# Altium project PiMX8MIO_release.PrjPcb
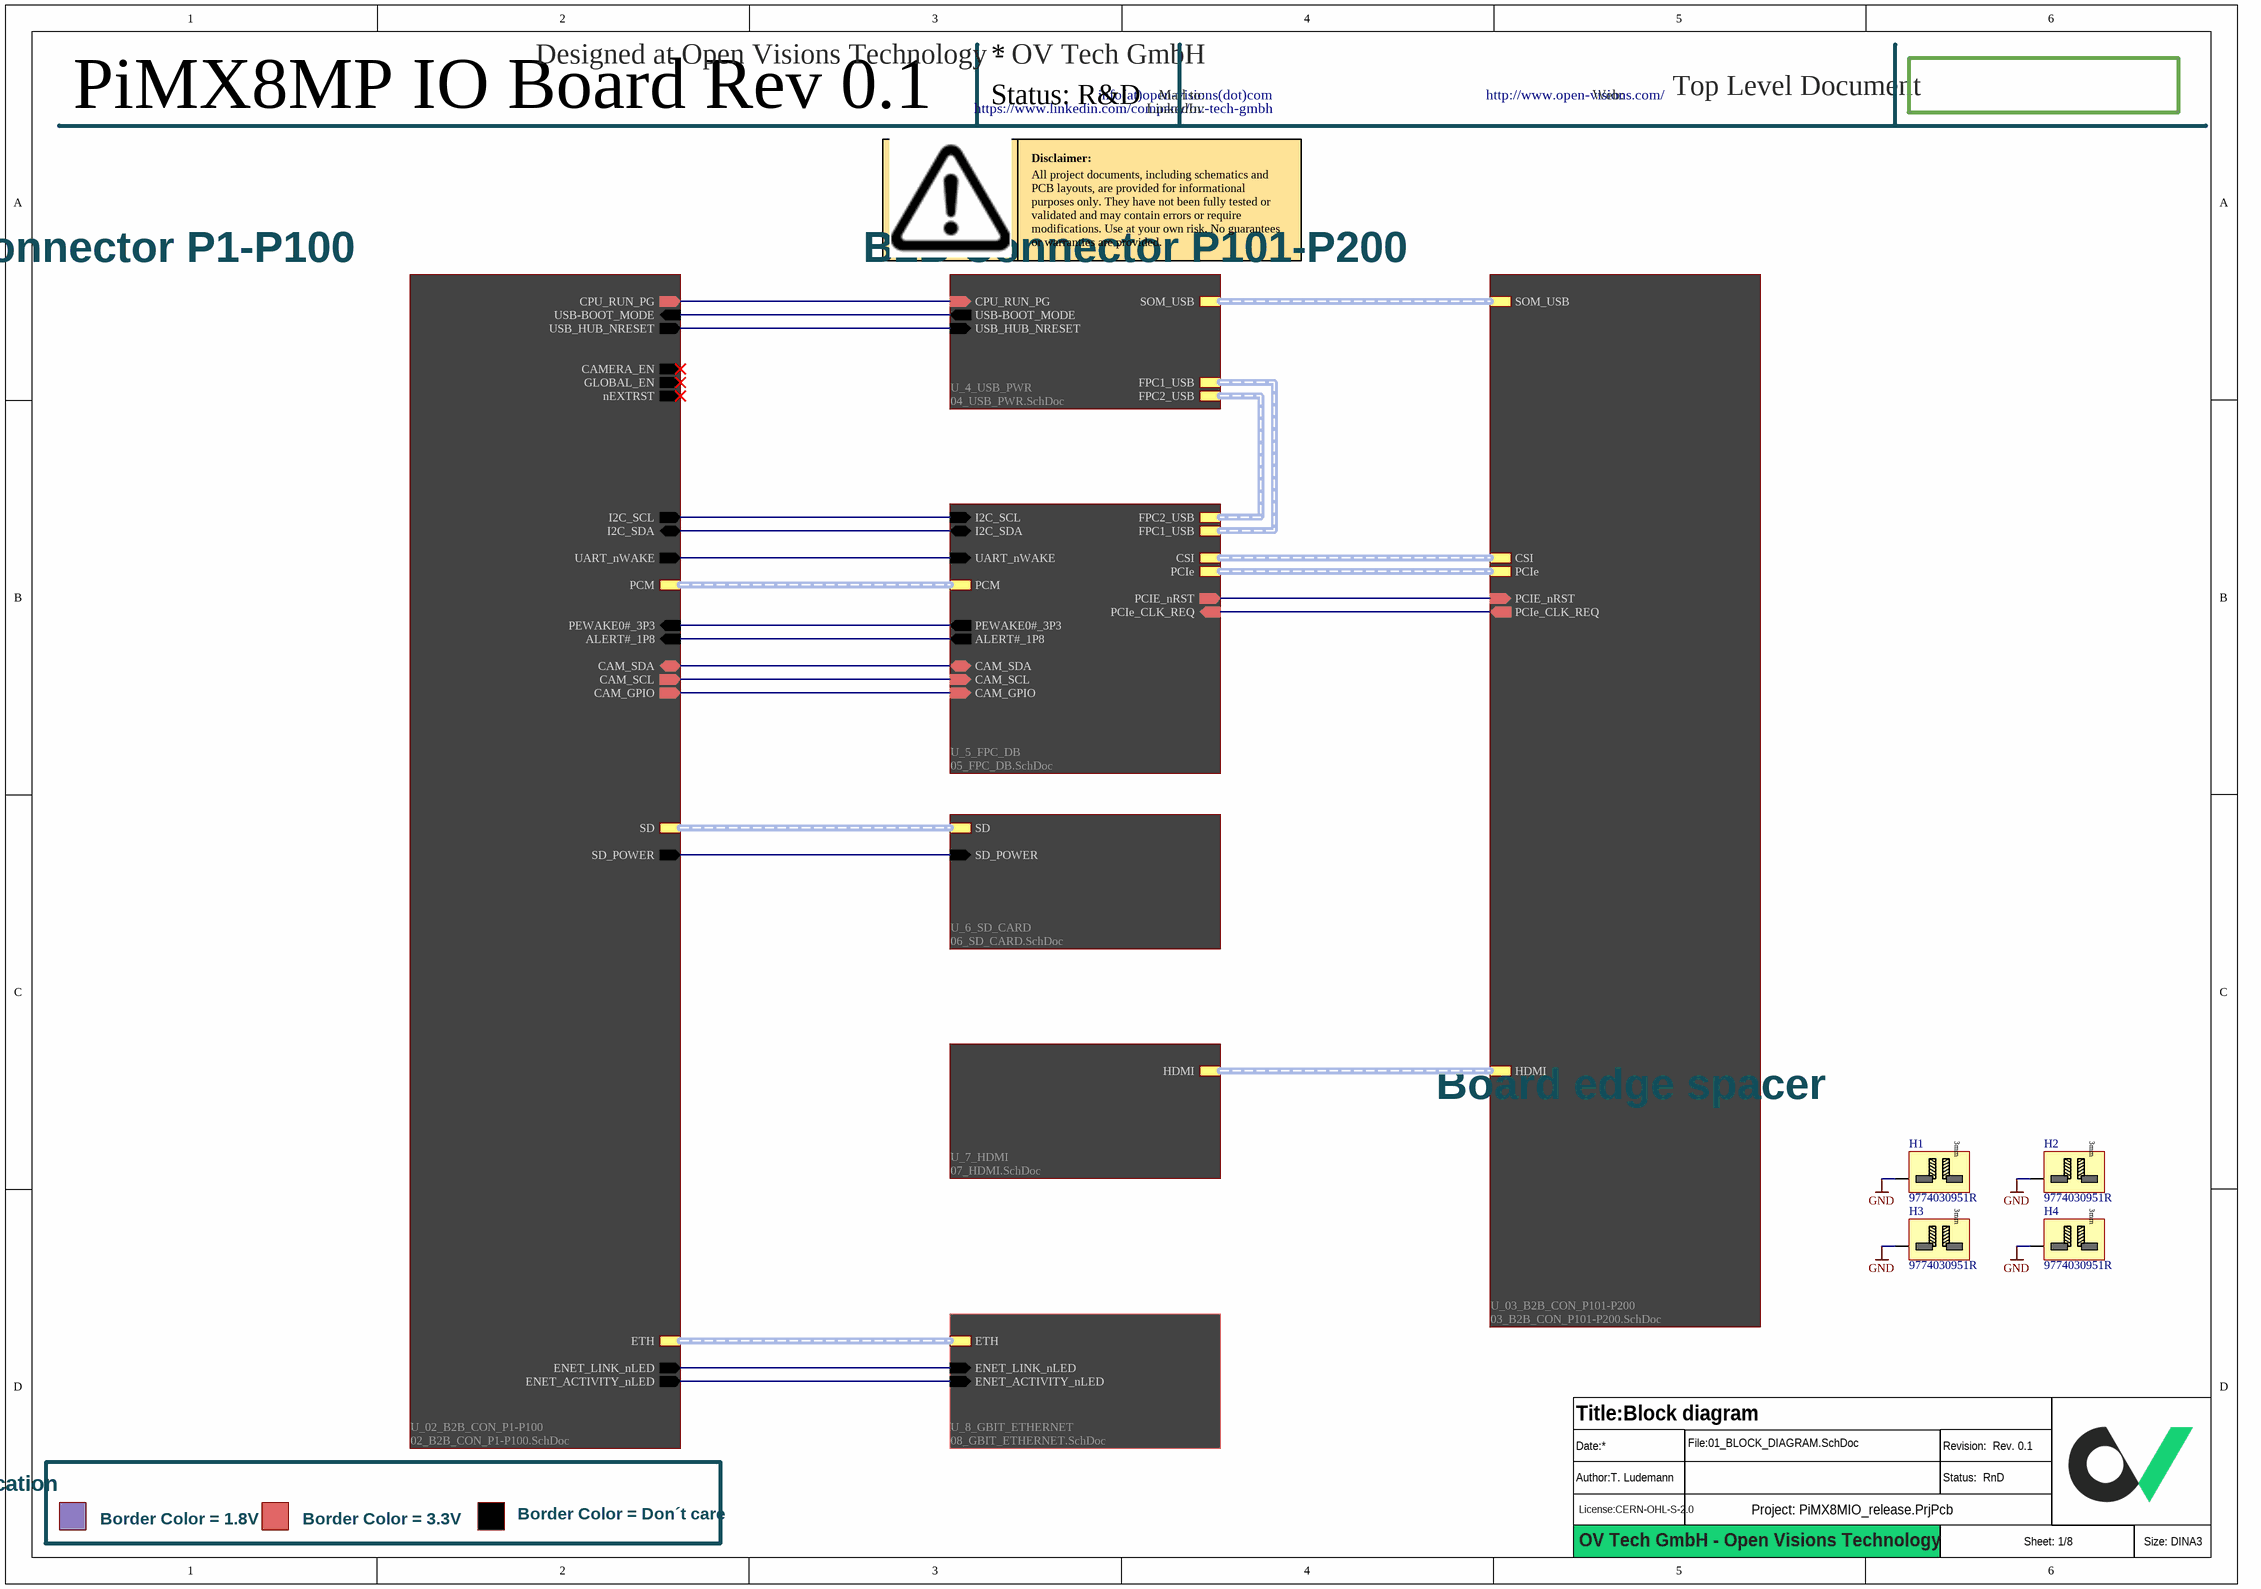
[diagram p0: 01_BLOCK_DIAGRAM.SchDoc]
ConfidialityLevel: Open-Source; Customer: OV Tech GmbH; DevStatus: RnD; License: CERN-OHL-S-2.0; PCBTitle: PiMX8MP IO Board; Project: PiMX8MP; Revision: Rev. 0.1
8 sheets, 139 parts. Net scope: hierarchical (ports join the sheet entries above them; power ports are global).
Board file: PiMX8MPIO_r0.1.PcbDoc
Sheets:
  01_BLOCK_DIAGRAM.SchDoc
    U_02_B2B_CON_P1-P100 = 02_B2B_CON_P1-P100.SchDoc
    U_4_USB_PWR = 04_USB_PWR.SchDoc
    U_5_FPC_DB = 05_FPC_DB.SchDoc
    U_6_SD_CARD = 06_SD_CARD.SchDoc
    U_7_HDMI = 07_HDMI.SchDoc
    U_8_GBIT_ETHERNET = 08_GBIT_ETHERNET.SchDoc
    U_03_B2B_CON_P101-P200 = 03_B2B_CON_P101-P200.SchDoc

## Sheet 01_BLOCK_DIAGRAM.SchDoc: Block diagram
size 420 x 297 mm; Author: T. Ludemann; SheetNumber: 1; SheetTotal: 8; DocSize: DINA3

### Parts
(Parts that share a designator on the sheet are numbered #1, #2 ... from top to bottom, then left to right.)
?#1  (no value)  (graphical)
H1  9774030951R  [Spacer_SMD_Ø2.7mmx3mm_9774030951]
H2  9774030951R  [Spacer_SMD_Ø2.7mmx3mm_9774030951]
H3  9774030951R  [Spacer_SMD_Ø2.7mmx3mm_9774030951]
H4  9774030951R  [Spacer_SMD_Ø2.7mmx3mm_9774030951]

### Sub-sheets
U_02_B2B_CON_P1-P100 = 02_B2B_CON_P1-P100.SchDoc: CPU_RUN_PG (out), USB-BOOT_MODE (in), USB_HUB_NRESET (out), SD (harness SD), SD_POWER (out), ETH (harness ETH), ENET_LINK_nLED (out), ENET_ACTIVITY_nLED (out), CAMERA_EN (out), GLOBAL_EN (out), nEXTRST (out), I2C_SCL (out), I2C_SDA (bidir), PEWAKE0#_3P3 (in), ALERT#_1P8 (in), UART_nWAKE (out), PCM (harness PCM), CAM_SDA (bidir), CAM_SCL (out), CAM_GPIO (out)
U_03_B2B_CON_P101-P200 = 03_B2B_CON_P101-P200.SchDoc: SOM_USB (harness SOM_USB), HDMI (harness HDMI), CSI (harness CSI), PCIe (harness PCIe), PCIE_nRST (in), PCIe_CLK_REQ (out)
U_4_USB_PWR = 04_USB_PWR.SchDoc: SOM_USB (harness SOM_USB), CPU_RUN_PG (in), USB-BOOT_MODE (out), USB_HUB_NRESET (in), FPC1_USB (harness FPC1_USB), FPC2_USB (harness FPC2_USB)
U_5_FPC_DB = 05_FPC_DB.SchDoc: CSI (harness CSI), PCIe (harness PCIe), FPC2_USB (harness FPC2_USB), FPC1_USB (harness FPC1_USB), PCIE_nRST (out), PCIe_CLK_REQ (in), I2C_SCL (in), I2C_SDA (bidir), PEWAKE0#_3P3 (out), ALERT#_1P8 (out), UART_nWAKE (in), PCM (harness PCM), CAM_SDA (bidir), CAM_SCL (in), CAM_GPIO (in)
U_6_SD_CARD = 06_SD_CARD.SchDoc: SD (harness SD), SD_POWER (in)
U_7_HDMI = 07_HDMI.SchDoc: HDMI (harness HDMI)
U_8_GBIT_ETHERNET = 08_GBIT_ETHERNET.SchDoc: ETH (harness ETH), ENET_LINK_nLED (in), ENET_ACTIVITY_nLED (in)

### Nets
GND: H1.MT H2.MT H3.MT H4.MT
ALERT#_1P8: sheet U_02_B2B_CON_P1-P100/ALERT#_1P8, sheet U_5_FPC_DB/ALERT#_1P8
CAM_GPIO: sheet U_02_B2B_CON_P1-P100/CAM_GPIO, sheet U_5_FPC_DB/CAM_GPIO
CAM_I2C_SCL: sheet U_02_B2B_CON_P1-P100/CAM_SCL, sheet U_5_FPC_DB/CAM_SCL
CAM_I2C_SDA: sheet U_02_B2B_CON_P1-P100/CAM_SDA, sheet U_5_FPC_DB/CAM_SDA
CPU_RUN_PG: sheet U_02_B2B_CON_P1-P100/CPU_RUN_PG, sheet U_4_USB_PWR/CPU_RUN_PG
ENET_ACTIVITY_nLED: sheet U_02_B2B_CON_P1-P100/ENET_ACTIVITY_nLED, sheet U_8_GBIT_ETHERNET/ENET_ACTIVITY_nLED
ENET_LINK_nLED: sheet U_02_B2B_CON_P1-P100/ENET_LINK_nLED, sheet U_8_GBIT_ETHERNET/ENET_LINK_nLED
FPC_PEWAKE0#_3P3: sheet U_02_B2B_CON_P1-P100/PEWAKE0#_3P3, sheet U_5_FPC_DB/PEWAKE0#_3P3
I2C_SCL: sheet U_02_B2B_CON_P1-P100/I2C_SCL, sheet U_5_FPC_DB/I2C_SCL
I2C_SDA: sheet U_02_B2B_CON_P1-P100/I2C_SDA, sheet U_5_FPC_DB/I2C_SDA
PCIe_CLK_REQ: sheet U_5_FPC_DB/PCIe_CLK_REQ, sheet U_03_B2B_CON_P101-P200/PCIe_CLK_REQ
PCIE_nRST: sheet U_5_FPC_DB/PCIE_nRST, sheet U_03_B2B_CON_P101-P200/PCIE_nRST
SD_POWER: sheet U_02_B2B_CON_P1-P100/SD_POWER, sheet U_6_SD_CARD/SD_POWER
UART_nWAKE: sheet U_02_B2B_CON_P1-P100/UART_nWAKE, sheet U_5_FPC_DB/UART_nWAKE
USB-BOOT_MODE: sheet U_02_B2B_CON_P1-P100/USB-BOOT_MODE, sheet U_4_USB_PWR/USB-BOOT_MODE
USB_HUB_NRESET: sheet U_02_B2B_CON_P1-P100/USB_HUB_NRESET, sheet U_4_USB_PWR/USB_HUB_NRESET

### Buses and harness runs
harness sheet U_02_B2B_CON_P1-P100/ETH = sheet U_8_GBIT_ETHERNET/ETH
harness sheet U_02_B2B_CON_P1-P100/PCM = sheet U_5_FPC_DB/PCM
harness sheet U_02_B2B_CON_P1-P100/SD = sheet U_6_SD_CARD/SD
harness sheet U_03_B2B_CON_P101-P200/CSI = sheet U_5_FPC_DB/CSI
harness sheet U_03_B2B_CON_P101-P200/HDMI = sheet U_7_HDMI/HDMI
harness sheet U_03_B2B_CON_P101-P200/PCIe = sheet U_5_FPC_DB/PCIe
harness sheet U_03_B2B_CON_P101-P200/SOM_USB = sheet U_4_USB_PWR/SOM_USB
harness sheet U_4_USB_PWR/FPC1_USB = sheet U_5_FPC_DB/FPC1_USB
harness sheet U_4_USB_PWR/FPC2_USB = sheet U_5_FPC_DB/FPC2_USB

### Notes on the sheet
- PiMX8MP IO Board Rev 0.1
- Status: R&D
- Designed at Open Visions Technology - OV Tech GmbH
- Mail to:
- LinkedIn:
- info(at)open-visions(dot)com
- https://www.linkedin.com/company/ov-tech-gmbh
- Web:
- http://www.open-visions.com/
- Top Level Document
- Disclaimer:
- B2B Connector P1-P100
- All project documents, including schematics and PCB layouts, are provided for informational purposes only. They have not been fully tested or validated and may contain errors or require modifications. Use at your own risk. No guarantees or warranties are provided.
- B2B Connector P101-P200
- USB + Power
- FPC DB Connector
- SD Card
- HDMI
- Board edge spacer
- Gbit Ethernet
- Signal Level Indication
- Border Color = 1.8V
- Border Color = 3.3V
- Border Color = Don´t care
- OV Tech GmbH - Open Visions Technology
- (in symbol Spacer_SMD_Ø2.7mm_internal_3mm) 3mm

### Library data of the parts
?#1 = Titleblock_01_OpenSource
H1-H4 = Spacer_SMD_Ø2.7mm_internal_3mm: Würth Elektronik SMD Spacer Ø2.7mm 3mm length; Manufacturer 1: Würth Elektronik; Manufacturer 1 Prt. Nr.: 9774030951R

## Sheet 02_B2B_CON_P1-P100.SchDoc: PiMX8MP Board to board connector P1 - P100
size 420 x 297 mm; Author: T. Ludemann; SheetNumber: 2; SheetTotal: 8; DocSize: DINA3
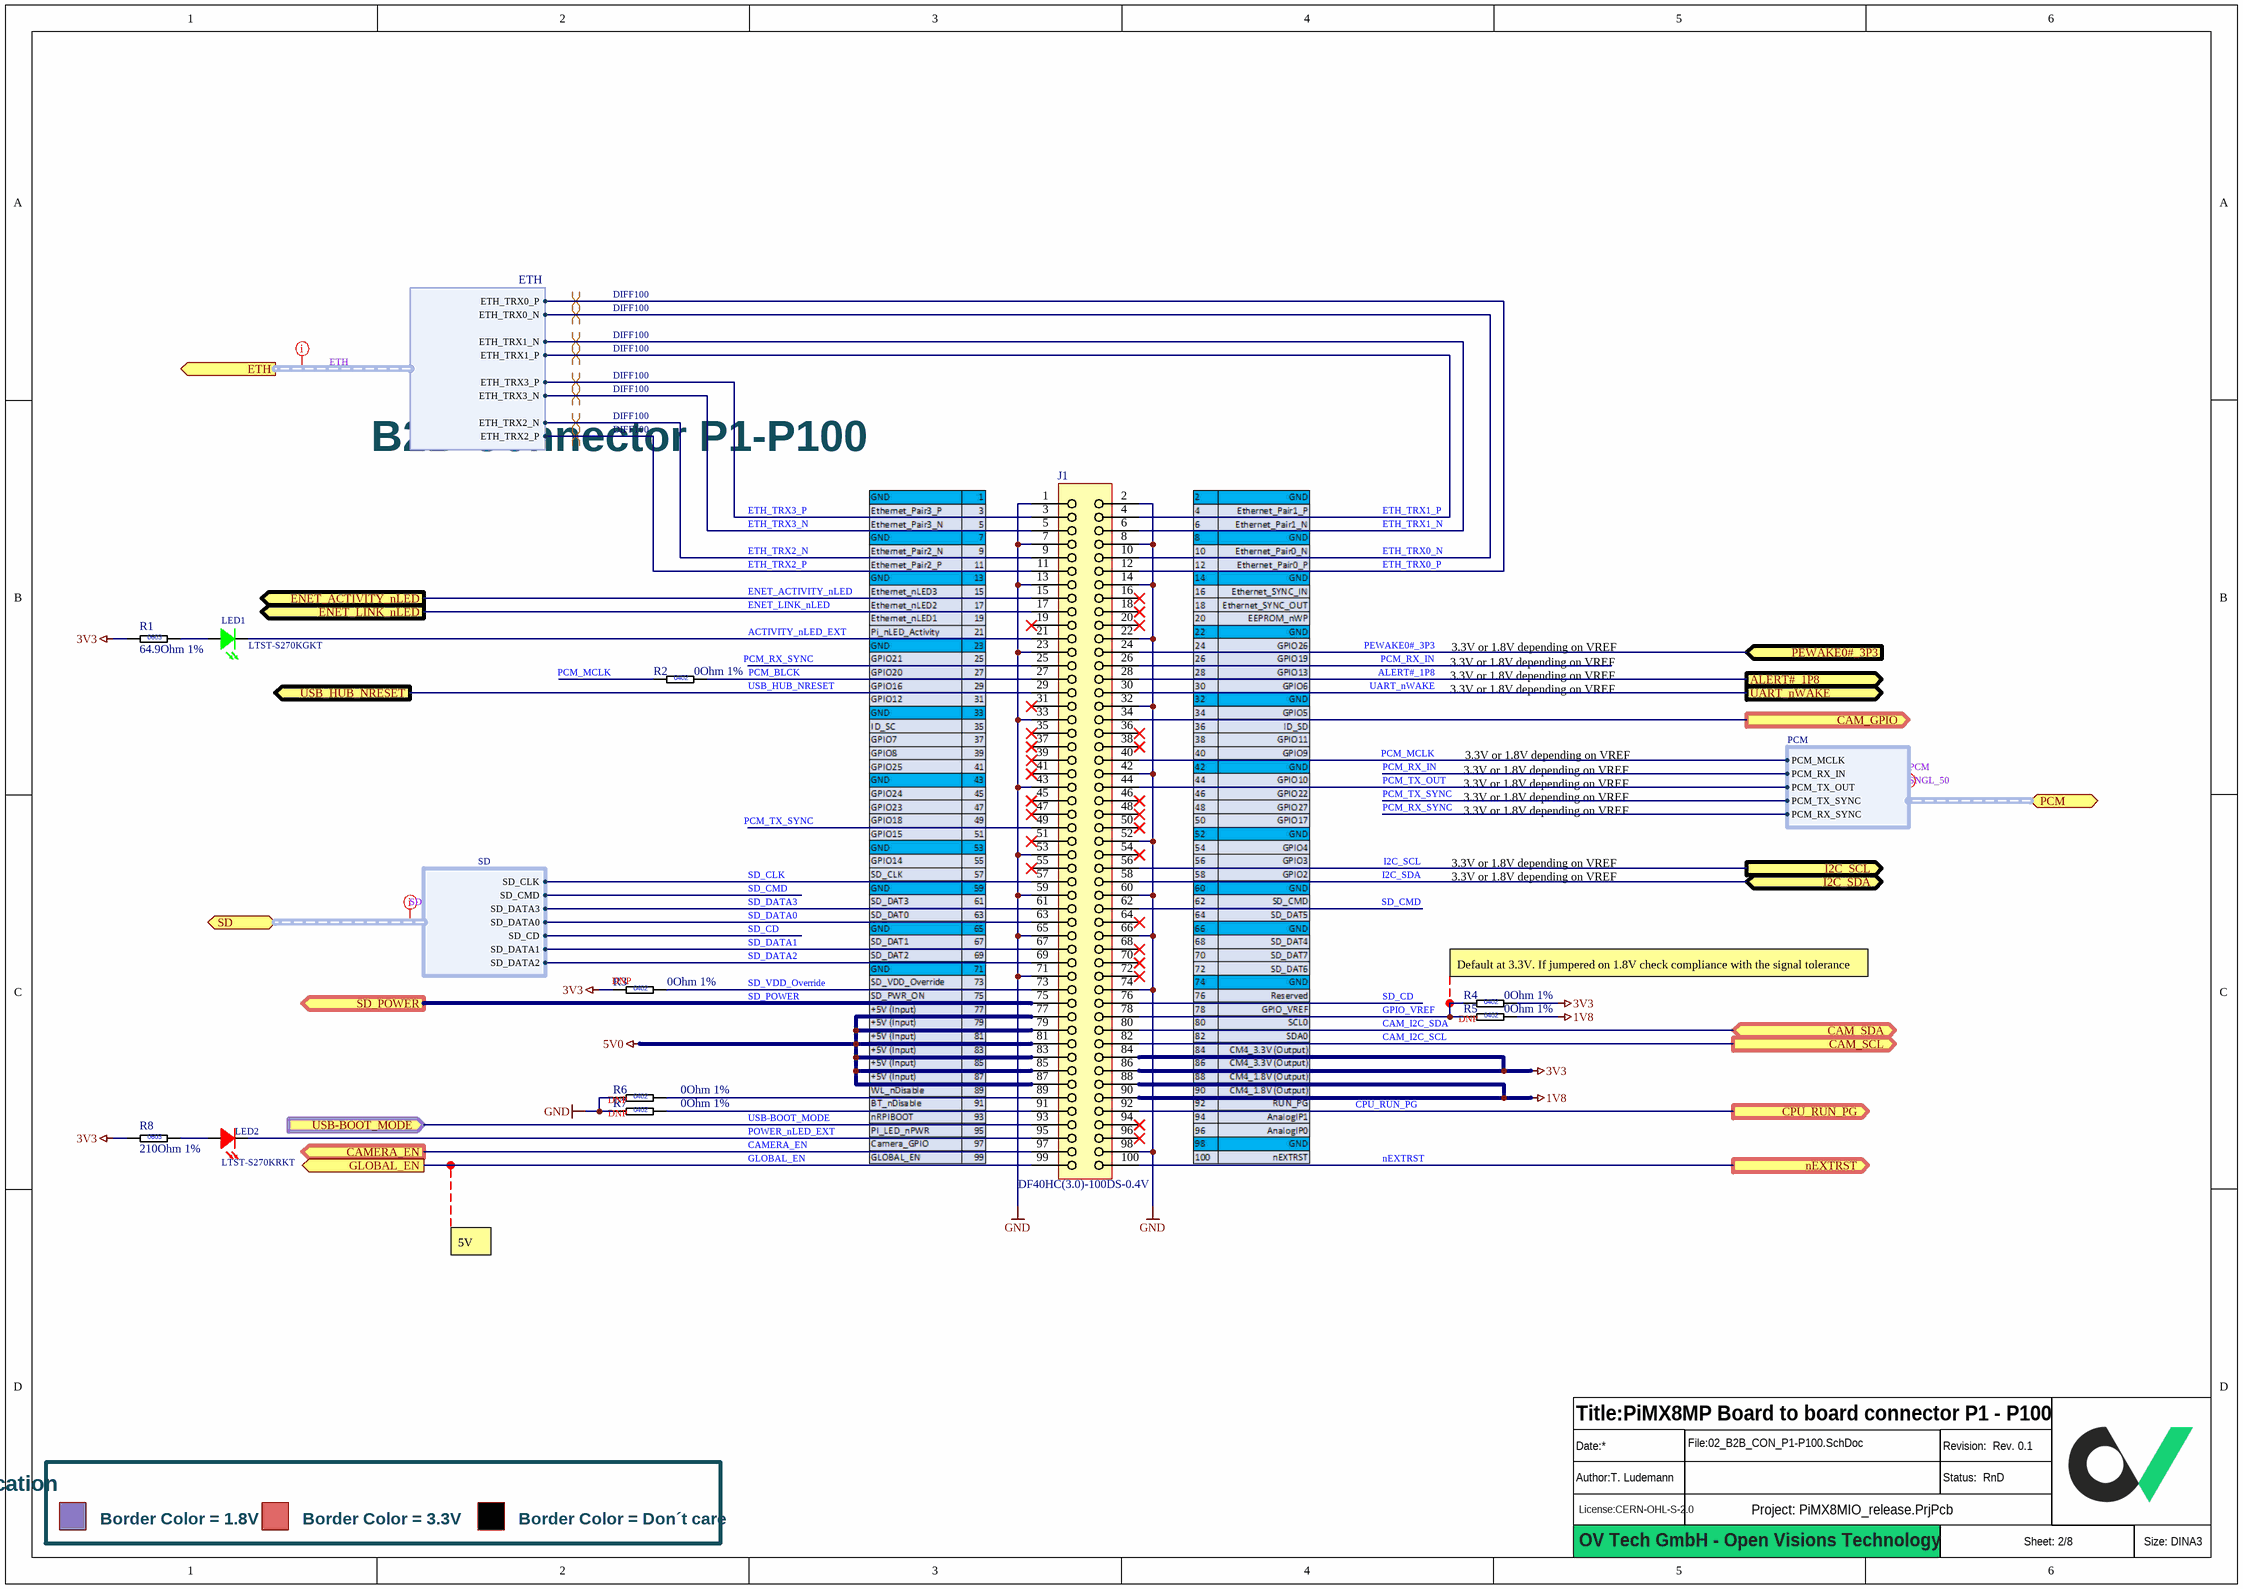
[diagram p1: 02_B2B_CON_P1-P100.SchDoc]

### Parts
(Parts that share a designator on the sheet are numbered #1, #2 ... from top to bottom, then left to right.)
?#2  (no value)  (graphical)
J1  DF40HC(3.0)-100DS-0.4V  [BOARD-TO-BOARD DF40HC(3.0)-100DS-0.4V]
LED1  LTST-S270KGKT  [LED 0605_LTST-S270KRKT]
LED2  LTST-S270KRKT  [LED 0605_LTST-S270KRKT]
R1  64.9Ohm 1%  [RESC1608X04L]
R2  0Ohm 1%  [RESC1005X04L]
R3  0Ohm 1%  [RESC1005X04L]
R4  0Ohm 1%  [RESC1005X04L]
R5  0Ohm 1%  [RESC1005X04L]
R6  0Ohm 1%  [RESC1005X04L]
R7  0Ohm 1%  [RESC1005X04L]
R8  210Ohm 1%  [RESC1608X04L]

### Ports
ALERT#_1P8 (out), CAM_GPIO (out), CAM_SCL (out), CAM_SDA (bidir), CAMERA_EN (out), CPU_RUN_PG (out), ENET_ACTIVITY_nLED (out), ENET_LINK_nLED (out), ETH (out, harness ETH), GLOBAL_EN (out), I2C_SCL (out), I2C_SDA (bidir), nEXTRST (out), PCM (bidir, harness PCM), PEWAKE0#_3P3 (in), SD (bidir, harness SD), SD_POWER (out), UART_nWAKE (out), USB-BOOT_MODE (in), USB_HUB_NRESET (out)

### Harnesses
ETH: ETH_TRX0_P, ETH_TRX0_N, ETH_TRX1_N, ETH_TRX1_P, ETH_TRX2_P, ETH_TRX2_N, ETH_TRX3_P, ETH_TRX3_N
SD: SD_CLK, SD_CMD, SD_CD, SD_DATA0, SD_DATA1, SD_DATA2, SD_DATA3
PCM: PCM_MCLK, PCM_TX_OUT, PCM_RX_IN, PCM_TX_SYNC, PCM_RX_SYNC

### Nets
1V8: J1.88 J1.90 R5.2
3V3: J1.84 J1.86 R1.1 R3.1 R4.2 R8.1
5V0: J1.77 J1.79 J1.81 J1.83 J1.85 J1.87
GND: J1.1 J1.2 J1.7 J1.8 J1.13 J1.14 J1.22 J1.23 J1.32 J1.33 J1.42 J1.43 J1.52 J1.53 J1.59 J1.60 J1.65 J1.66 J1.71 J1.74 J1.98 R6.1 R7.1
ACTIVITY_nLED_EXT: J1.21 LED1.1
ALERT#_1P8: J1.28 ; port ALERT#_1P8
CAM_GPIO: J1.34 ; port CAM_GPIO
CAM_I2C_SCL: J1.82 ; port CAM_SCL
CAM_I2C_SDA: J1.80 ; port CAM_SDA
CAMERA_EN: J1.97 ; port CAMERA_EN
CPU_RUN_PG: J1.92 ; port CPU_RUN_PG
ENET_ACTIVITY_nLED: J1.15 ; port ENET_ACTIVITY_nLED
ENET_LINK_nLED: J1.17 ; port ENET_LINK_nLED
ETH_TRX0_N: J1.10 ; port ETH.ETH_TRX0_N
ETH_TRX0_P: J1.12 ; port ETH.ETH_TRX0_P
ETH_TRX1_N: J1.6 ; port ETH.ETH_TRX1_N
ETH_TRX1_P: J1.4 ; port ETH.ETH_TRX1_P
ETH_TRX2_N: J1.9 ; port ETH.ETH_TRX2_N
ETH_TRX2_P: J1.11 ; port ETH.ETH_TRX2_P
ETH_TRX3_N: J1.5 ; port ETH.ETH_TRX3_N
ETH_TRX3_P: J1.3 ; port ETH.ETH_TRX3_P
GLOBAL_EN: J1.99 ; port GLOBAL_EN
GPIO_VREF: J1.78 R4.1 R5.1
I2C_SCL: J1.56 ; port I2C_SCL
I2C_SDA: J1.58 ; port I2C_SDA
nEXTRST: J1.100 ; port nEXTRST
PCM_BLCK: J1.27 R2.2
PCM_MCLK: J1.40 R2.1 ; port PCM.PCM_MCLK
PCM_RX_IN: J1.26 ; port PCM.PCM_RX_IN
PCM_RX_SYNC: J1.25 ; port PCM.PCM_RX_SYNC
PCM_TX_OUT: J1.44 ; port PCM.PCM_TX_OUT
PCM_TX_SYNC: J1.49 ; port PCM.PCM_TX_SYNC
PEWAKE0#_3P3: J1.24 ; port PEWAKE0#_3P3  [project net FPC_PEWAKE0#_3P3]
POWER_nLED_EXT: J1.95 LED2.1
SD_CD: J1.76 ; port SD.SD_CD
SD_CLK: J1.57 ; port SD.SD_CLK
SD_CMD: J1.62 ; port SD.SD_CMD
SD_DATA0: J1.63 ; port SD.SD_DATA0
SD_DATA1: J1.67 ; port SD.SD_DATA1
SD_DATA2: J1.69 ; port SD.SD_DATA2
SD_DATA3: J1.61 ; port SD.SD_DATA3
SD_POWER: J1.75 ; port SD_POWER
SD_VDD_Override: J1.73 R3.2
UART_nWAKE: J1.30 ; port UART_nWAKE
USB-BOOT_MODE: J1.93 ; port USB-BOOT_MODE
USB_HUB_NRESET: J1.29 ; port USB_HUB_NRESET
NetJ1_89: J1.89 R6.2
NetJ1_91: J1.91 R7.2
NetLED1_2: LED1.2 R1.2
NetLED2_2: LED2.2 R8.2

Not connected (* = marked no-connect by the designer): J1 16* 18* 19* 20* 31* 35* 36* 37* 38* 39* 41* 45* 46* 47* 48* 50* 51* 54* 55* 64* 68* 70* 72* 94* 96*

### Layout directives
net class SD: (no net found under the mark)
net class ETH: (no net found under the mark)
differential pair; differential pair class DIFF100: ETH_TRX0_N, ETH_TRX0_P, ETH_TRX1_N, ETH_TRX1_P, ETH_TRX2_N, ETH_TRX2_P, ETH_TRX3_N, ETH_TRX3_P
net class PCM; net class SNGL_50: (no net found under the mark)

### Notes on the sheet
- (near J1) B2B Connector P1-P100
- 3.3V or 1.8V depending on VREF
- (near R3) DNP
- Default at 3.3V. If jumpered on 1.8V check compliance with the signal tolerance
- (near R5) DNP
- (near R6) DNP
- (near R7) DNP
- 5V
- Signal Level Indication
- Border Color = 1.8V
- Border Color = 3.3V
- Border Color = Don´t care
- OV Tech GmbH - Open Visions Technology
- (in symbol RES_0402_0R_1%) 0402
- (in symbol RES_0603_64.9R_1%) 0603
- (in symbol RES_0603_210R_1%) 0603

### Library data of the parts
?#2 = Titleblock_01_OpenSource
J1 = Board to Board Connector Receptable_BTB_100P_04mm_DF40HC(3.0)-100DS-0.4V: Board to Board connector 100Pol Stacking Header Receptable  0.4mm Pitch; Manufacturer 1: Hirose Connector; Manufacturer 1 Prt. Nr.: DF40HC(3.0)-100DS-0.4V
LED1 = LED Green Sideview_LTST-S270KGKT: Standard LEDs 0605 Sideview - SMD Green Clear 571nm; Manufacturer 1: Lite-On; Manufacturer 1 Prt. Nr.: LTST-S270KGKT
LED2 = LED Red Sideview_LTST-S270KRKT: Standard LEDs 0605 Sideview - SMD Red Clear 631nm; Manufacturer 1: Lite-On; Manufacturer 1 Prt. Nr.: LTST-S270KRKT
R1 = RES_0603_64.9R_1%: Thick Film Resistors - SMD 64.9OHM 1%; Manufacturer 1: Vishay / Dale; Manufacturer 1 Prt. Nr.: CRCW060364R9FKEA; Manufacturer 2 Prt. Nr.: ERJ-3EKF64R9V; Manufacturer 2: Panasonic
R2-R7 = RES_0402_0R_1%: Thick Film Resistors - SMD 0OHM 1%; Manufacturer 1: Bourns; Manufacturer 1 Prt. Nr.: CR0402AJ/-000GAS; Manufacturer 2 Prt. Nr.: AC0402FR-070RL; Manufacturer 2: YAGEO
R8 = RES_0603_210R_1%: Thick Film Resistors - SMD 210OHM 1%; Manufacturer 1: Bourns; Manufacturer 1 Prt. Nr.: CR0603-FX-2100ELF; Manufacturer 2 Prt. Nr.: CRCW0603210RFKEA; Manufacturer 2: Vishay / Dale

## Sheet 04_USB_PWR.SchDoc: USB & POWER
size 594 x 420 mm; Author: T. Ludemann; SheetNumber: 4; SheetTotal: 8; DocSize: DINA2
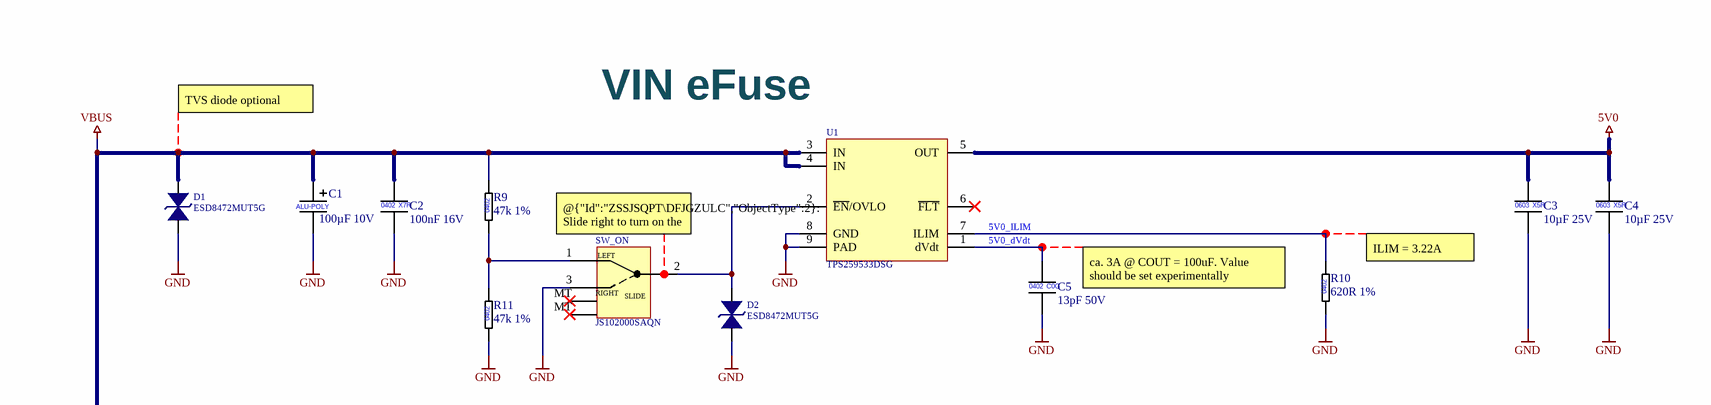
[diagram p2: 04_USB_PWR.SchDoc, top left]
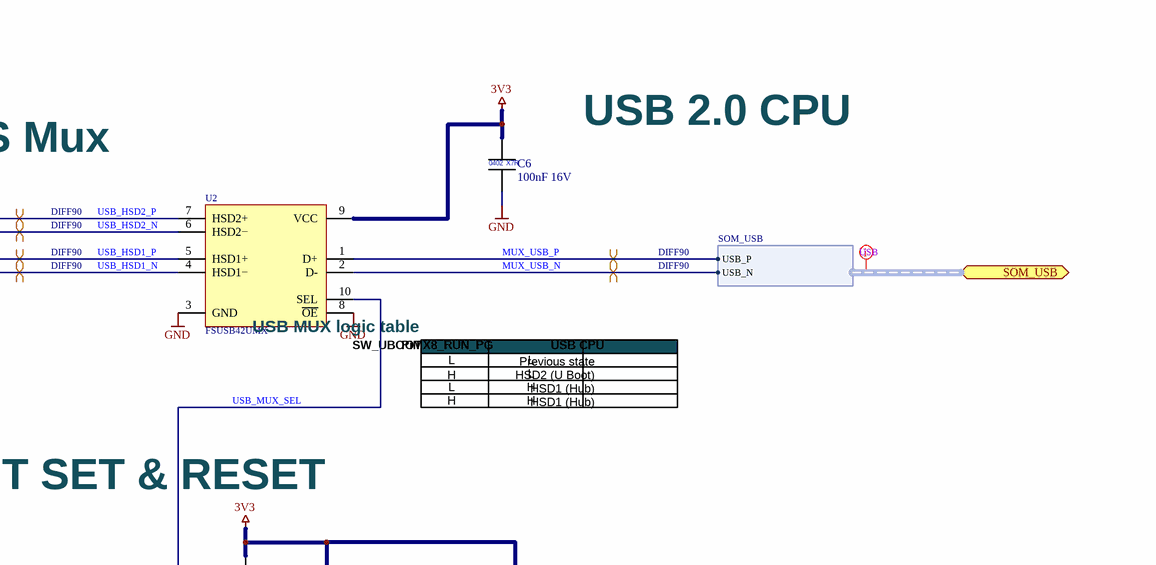
[diagram p3: 04_USB_PWR.SchDoc, top right]
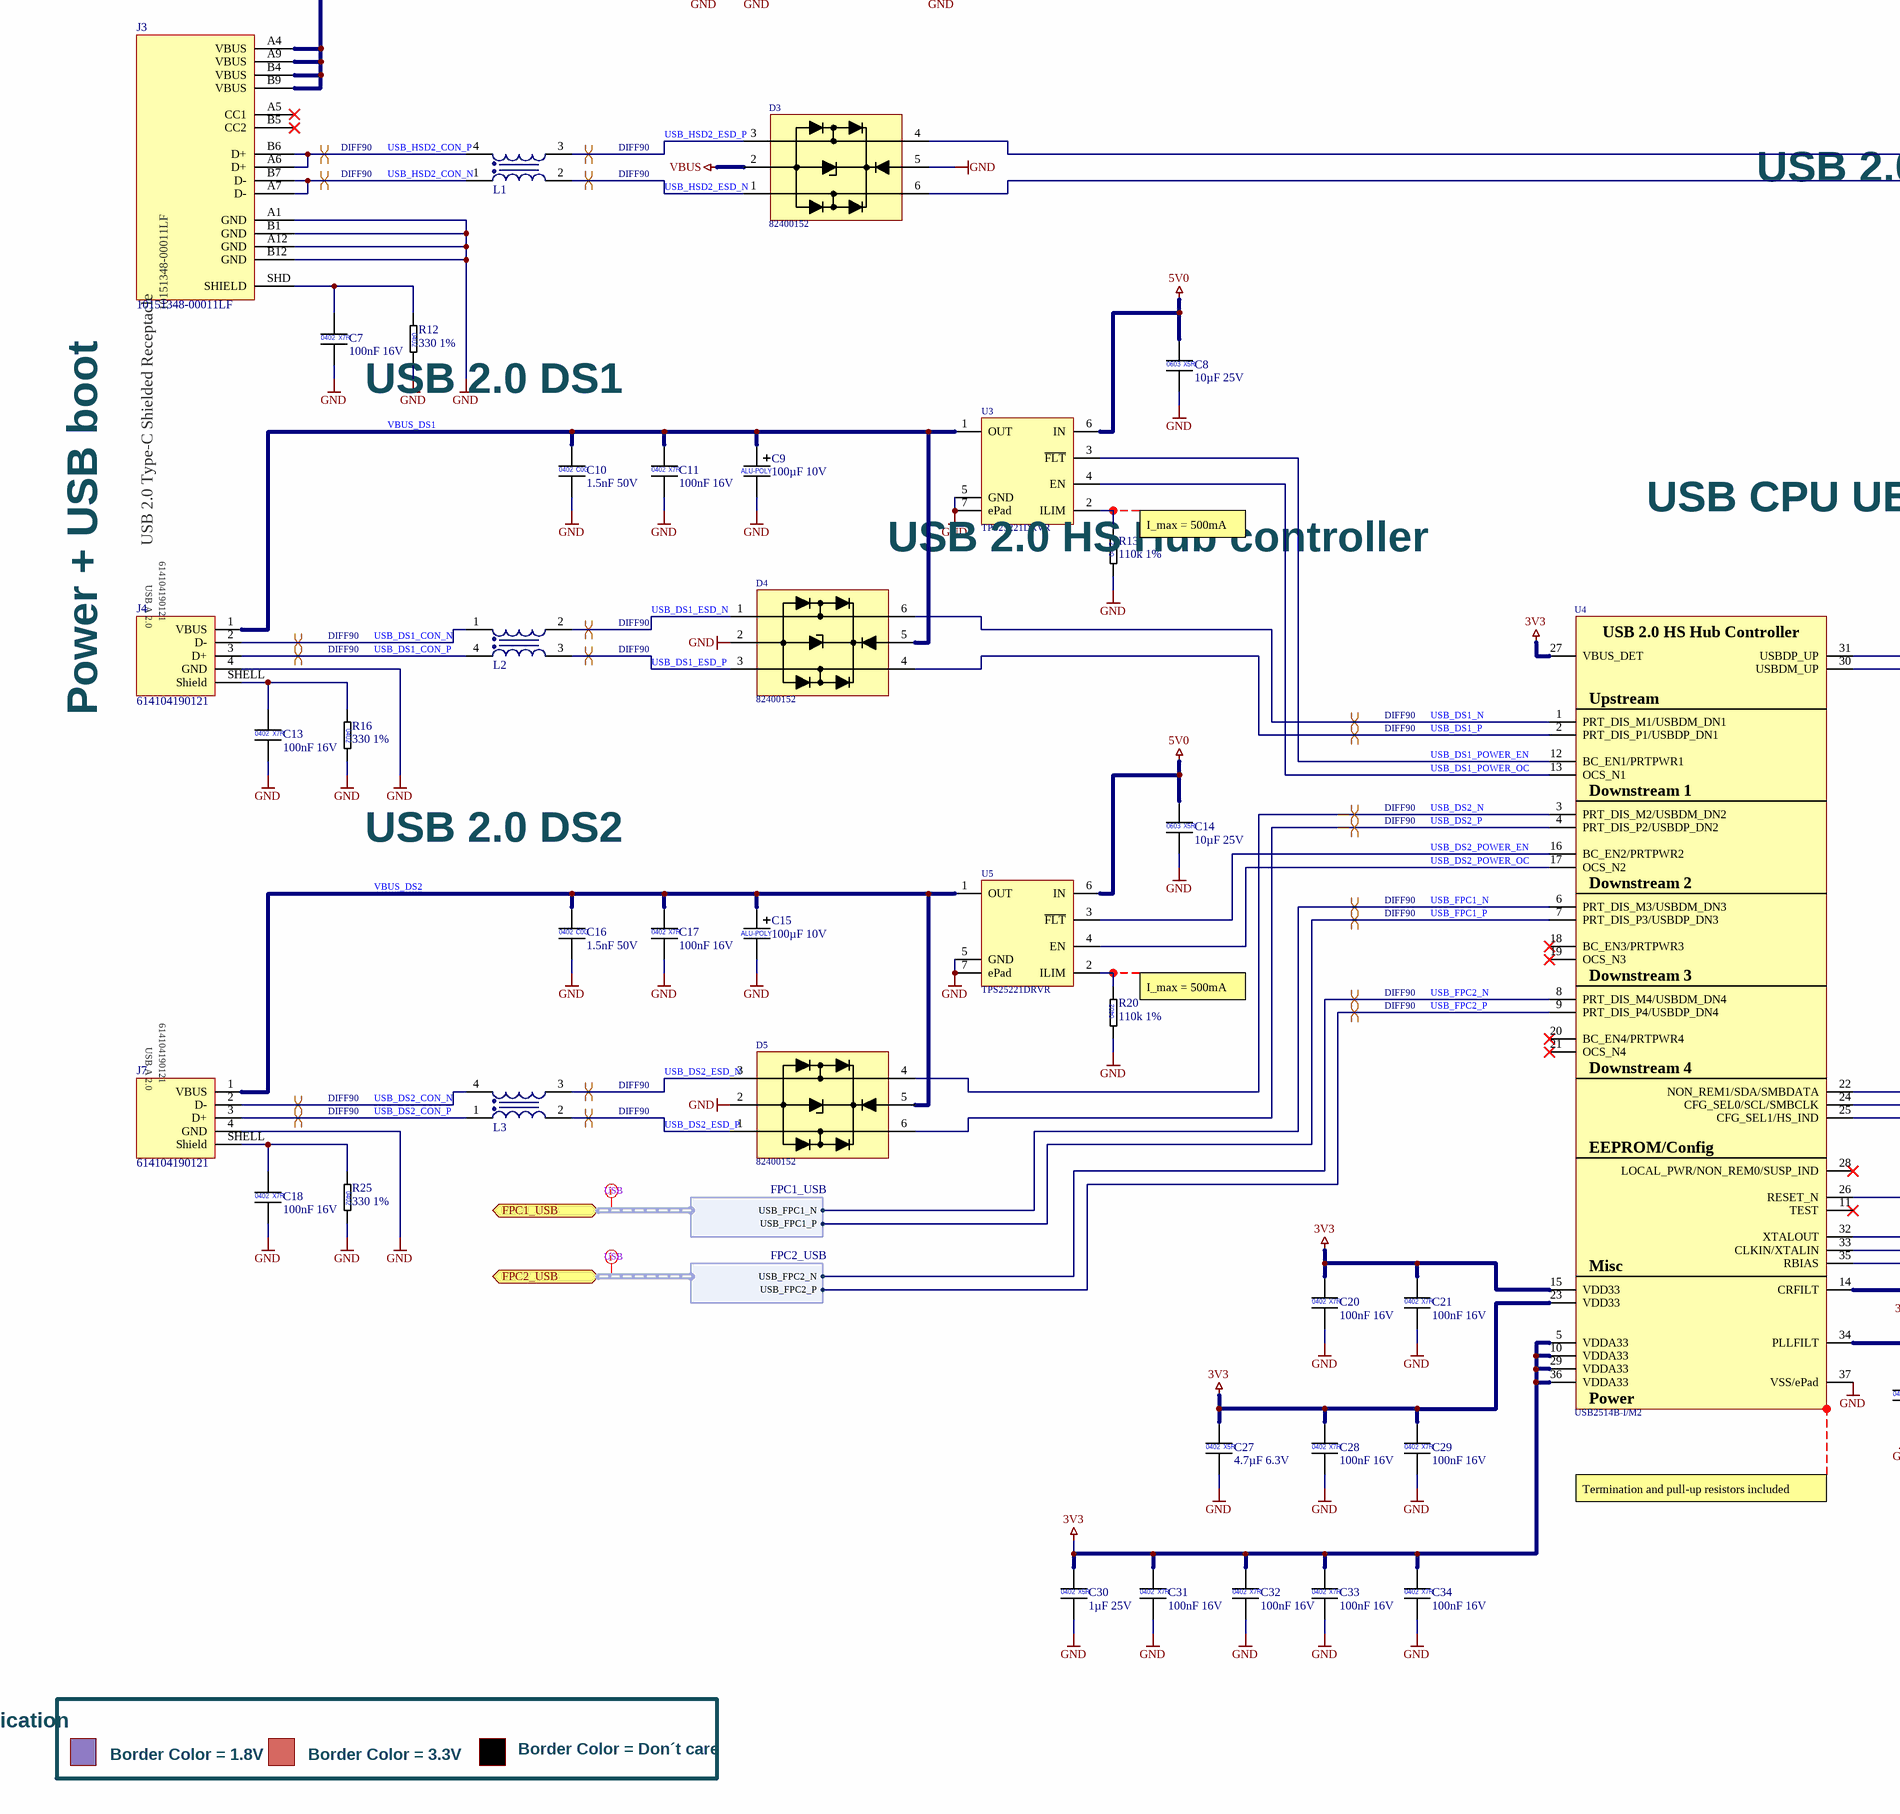
[diagram p4: 04_USB_PWR.SchDoc, bottom left]
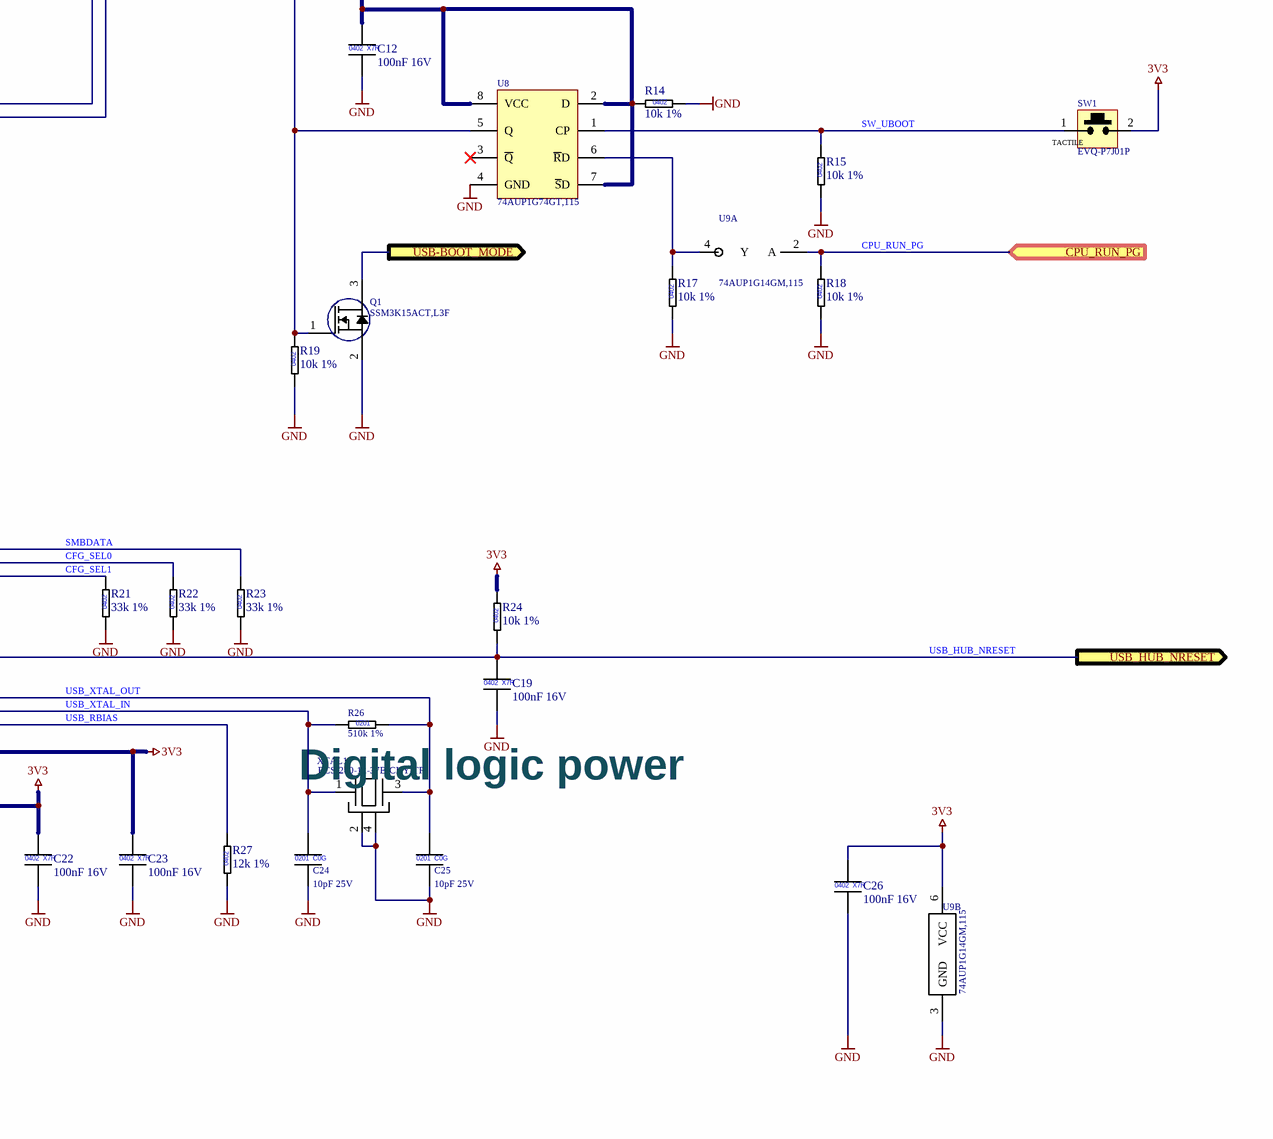
[diagram p5: 04_USB_PWR.SchDoc, bottom right]

### Parts
(Parts that share a designator on the sheet are numbered #1, #2 ... from top to bottom, then left to right.)
?#3  (no value)  (graphical)
C1  100µF 10V  [CAP_Radial_5x8mm]
C2  100nF 16V  [CAPC1005X06L]
C3  10µF 25V  [CAPC1608X10L]
C4  10µF 25V  [CAPC1608X10L]
C5  13pF 50V  [CAPC1005X06L]
C6  100nF 16V  [CAPC1005X06L]
C7  100nF 16V  [CAPC1005X06L]
C8  10µF 25V  [CAPC1608X10L]
C9  100µF 10V  [CAP_Radial_5x8mm]
C10  1.5nF 50V  [CAPC1005X06L]
C11  100nF 16V  [CAPC1005X06L]
C12  100nF 16V  [CAPC1005X06L]
C13  100nF 16V  [CAPC1005X06L]
C14  10µF 25V  [CAPC1608X10L]
C15  100µF 10V  [CAP_Radial_5x8mm]
C16  1.5nF 50V  [CAPC1005X06L]
C17  100nF 16V  [CAPC1005X06L]
C18  100nF 16V  [CAPC1005X06L]
C19  100nF 16V  [CAPC1005X06L]
C20  100nF 16V  [CAPC1005X06L]
C21  100nF 16V  [CAPC1005X06L]
C22  100nF 16V  [CAPC1005X06L]
C23  100nF 16V  [CAPC1005X06L]
C24  10pF 25V  [CAPC0603X03L]
C25  10pF 25V  [CAPC0603X03L]
C26  100nF 16V  [CAPC1005X06L]
C27  4.7µF 6.3V  [CAPC1005X06L]
C28  100nF 16V  [CAPC1005X06L]
C29  100nF 16V  [CAPC1005X06L]
C30  1µF 25V  [CAPC1005X06L]
C31  100nF 16V  [CAPC1005X06L]
C32  100nF 16V  [CAPC1005X06L]
C33  100nF 16V  [CAPC1005X06L]
C34  100nF 16V  [CAPC1005X06L]
D1  ESD8472MUT5G  [DFN36P62X33-2L]
D2  ESD8472MUT5G  [DFN36P62X33-2L]
D3  82400152  [WE-TVS_SOT563]
D4  82400152  [WE-TVS_SOT563]
D5  82400152  [WE-TVS_SOT563]
J3  10151348-00011LF  [USB Type C - 10151348-00011LF]
J4  614104190121  [USB Type A - 614104190121]
J7  614104190121  [USB Type A - 614104190121]
L1  90Ohm 100mA  [WE-CNSW_0603]  (value not drawn)
L2  90Ohm 100mA  [WE-CNSW_0603]  (value not drawn)
L3  90Ohm 100mA  [WE-CNSW_0603]  (value not drawn)
Q1  SSM3K15ACT,L3F  [DFN65P100X50-3L]
R9  47k 1%  [RESC1005X04L]
R10  620R 1%  [RESC1005X04L]
R11  47k 1%  [RESC1005X04L]
R12  330 1%  [RESC1005X04L]
R13  110k 1%  [RESC1005X04L]
R14  10k 1%  [RESC1005X04L]
R15  10k 1%  [RESC1005X04L]
R16  330 1%  [RESC1005X04L]
R17  10k 1%  [RESC1005X04L]
R18  10k 1%  [RESC1005X04L]
R19  10k 1%  [RESC1005X04L]
R20  110k 1%  [RESC1005X04L]
R21  33k 1%  [RESC1005X04L]
R22  33k 1%  [RESC1005X04L]
R23  33k 1%  [RESC1005X04L]
R24  10k 1%  [RESC1005X04L]
R25  330 1%  [RESC1005X04L]
R26  510k 1%  [RESC0603X03L]
R27  12k 1%  [RESC1005X04L]
SW1  EVQ-P7J01P  [SW_TACT_EVQ-P7J01P]
SW_ON  JS102000SAQN  [SW_SLIDE-SWITCH_JS102000SAQN]
U1  TPS259533DSG  [SON50P200X80_HS-9N]
U2  FSUSB42UMX  [FSUSB42_UQFN10 1.4x1.8, 0.4P]
U3  TPS25221DRVR  [SON65P200X80_HS-7N]
U4  USB2514B-I/M2  [QFN50P600X600X100_HS-37M]
U5  TPS25221DRVR  [SON65P200X80_HS-7N]
U8  74AUP1G74GT,115  [PSON50P100X50-8L]
U9  74AUP1G14GM,115  [PSON50P140X100X50-6L]  (parts A,B of 2)
XTAL1  ECS-240-12-37B-CKY-TR  [XTAL_ECX-1637B_2X1.6X0.5]

### Ports
CPU_RUN_PG (in), FPC1_USB (bidir, harness FPC1_USB), FPC2_USB (bidir, harness FPC2_USB), SOM_USB (bidir, harness SOM_USB), USB-BOOT_MODE (out), USB_HUB_NRESET (out)

### Harnesses
SOM_USB: USB_P, USB_N
FPC1_USB: USB_FPC1_P, USB_FPC1_N
FPC2_USB: USB_FPC2_P, USB_FPC2_N

### Nets
3V3: C6.1 C12.1 C20.1 C21.1 C22.1 C23.1 C26.1 C27.1 C28.1 C29.1 C30.1 C31.1 C32.1 C33.1 C34.1 R14.1 R24.2 SW1.2 U2.9(VCC) U4.5(VDDA33) U4.10(VDDA33) U4.14(CRFILT) U4.15(VDD33) U4.23(VDD33) U4.27(VBUS_DET) U4.29(VDDA33) U4.34(PLLFILT) U4.36(VDDA33) U8.2(D) U8.7(~{S}D) U8.8(VCC) U9.6(VCC)
5V0: C3.1 C4.1 C8.1 C14.1 U1.5(OUT) U3.6(IN) U5.6(IN)
GND: C1.2 C2.2 C3.2 C4.2 C5.2 C6.2 C7.2 C8.2 C9.2 C10.2 C11.2 C12.2 C13.2 C14.2 C15.2 C16.2 C17.2 C18.2 C19.2 C20.2 C21.2 C22.2 C23.2 C24.2 C25.2 C26.2 C27.2 C28.2 C29.2 C30.2 C31.2 C32.2 C33.2 C34.2 D1.2 D2.2 D3.5(VDD) D4.2(GND) D5.2(GND) J3.A1(GND) J3.A12(GND) J3.B1(GND) J3.B12(GND) J4.4(GND) J7.4(GND) Q1.2(S) R10.1 R11.1 R12.2 R13.1 R14.2 R15.1 R16.2 R17.1 R18.1 R19.1 R20.1 R21.1 R22.1 R23.1 R25.2 R27.1 SW_ON.3 U1.8(GND) U1.9(PAD) U2.3(GND) U2.8(~{OE}) U3.5(GND) U3.7(ePad) U4.37(VSS/ePad) U5.5(GND) U5.7(ePad) U8.4(GND) U9.3(GND) XTAL1.2 XTAL1.4
VBUS: C1.1 C2.1 D1.1 D3.2(GND) J3.A4(VBUS) J3.A9(VBUS) J3.B4(VBUS) J3.B9(VBUS) R9.2 U1.3(IN) U1.4(IN)
5V0_dVdt: C5.1 U1.1(dVdt)
5V0_ILIM: R10.2 U1.7(ILIM)
CFG_SEL0: R22.2 U4.24(CFG_SEL0/SCL/SMBCLK)
CFG_SEL1: R21.2 U4.25(CFG_SEL1/HS_IND)
CPU_RUN_PG: R18.2 U9.2(A) ; port CPU_RUN_PG
MUX_USB_N: U2.2(D-) ; port SOM_USB.USB_N
MUX_USB_P: U2.1(D+) ; port SOM_USB.USB_P
SMBDATA: R23.2 U4.22(NON_REM1/SDA/SMBDATA)
SW_UBOOT: R15.2 SW1.1 U8.1(CP)
USB-BOOT_MODE: Q1.3(D) ; port USB-BOOT_MODE
USB_DS1_CON_N: J4.2(D-) L2.1
USB_DS1_CON_P: J4.3(D+) L2.4
USB_DS1_ESD_N: D4.1(I/O_1) L2.2
USB_DS1_ESD_P: D4.3(I/O_2) L2.3
USB_DS1_N: D4.6(I/O_1) U4.1(PRT_DIS_M1/USBDM_DN1)
USB_DS1_P: D4.4(I/O_2) U4.2(PRT_DIS_P1/USBDP_DN1)
USB_DS1_POWER_EN: U3.3(~{FLT}) U4.12(BC_EN1/PRTPWR1)
USB_DS1_POWER_OC: U3.4(EN) U4.13(OCS_N1)
USB_DS2_CON_N: J7.2(D-) L3.4
USB_DS2_CON_P: J7.3(D+) L3.1
USB_DS2_ESD_N: D5.3(I/O_2) L3.3
USB_DS2_ESD_P: D5.1(I/O_1) L3.2
USB_DS2_N: D5.4(I/O_2) U4.3(PRT_DIS_M2/USBDM_DN2)
USB_DS2_P: D5.6(I/O_1) U4.4(PRT_DIS_P2/USBDP_DN2)
USB_DS2_POWER_EN: U4.16(BC_EN2/PRTPWR2) U5.3(~{FLT})
USB_DS2_POWER_OC: U4.17(OCS_N2) U5.4(EN)
USB_FPC1_N: U4.6(PRT_DIS_M3/USBDM_DN3) ; port FPC1_USB.USB_FPC1_N
USB_FPC1_P: U4.7(PRT_DIS_P3/USBDP_DN3) ; port FPC1_USB.USB_FPC1_P
USB_FPC2_N: U4.8(PRT_DIS_M4/USBDM_DN4) ; port FPC2_USB.USB_FPC2_N
USB_FPC2_P: U4.9(PRT_DIS_P4/USBDP_DN4) ; port FPC2_USB.USB_FPC2_P
USB_HSD1_N: U2.4(HSD1−) U4.30(USBDM_UP)
USB_HSD1_P: U2.5(HSD1+) U4.31(USBDP_UP)
USB_HSD2_CON_N: J3.A7(D-) J3.B7(D-) L1.1
USB_HSD2_CON_P: J3.A6(D+) J3.B6(D+) L1.4
USB_HSD2_ESD_N: D3.1(I/O_1) L1.2
USB_HSD2_ESD_P: D3.3(I/O_2) L1.3
USB_HSD2_N: D3.6(I/O_1) U2.6(HSD2−)
USB_HSD2_P: D3.4(I/O_2) U2.7(HSD2+)
USB_HUB_NRESET: C19.1 R24.1 U4.26(RESET_N) ; port USB_HUB_NRESET
USB_MUX_SEL: Q1.1(G) R19.2 U2.10(SEL) U8.5(Q)
USB_RBIAS: R27.2 U4.35(RBIAS)
USB_XTAL_IN: C24.1 R26.1 U4.33(CLKIN/XTALIN) XTAL1.1
USB_XTAL_OUT: C25.1 R26.2 U4.32(XTALOUT) XTAL1.3
VBUS_DS1: C9.1 C10.1 C11.1 D4.5(VDD) J4.1(VBUS) U3.1(OUT)
VBUS_DS2: C15.1 C16.1 C17.1 D5.5(VDD) J7.1(VBUS) U5.1(OUT)
NetC7_1: C7.1 J3.SHD(SHIELD) R12.1
NetC13_1: C13.1 J4.SHELL(Shield) R16.1
NetC18_1: C18.1 J7.SHELL(Shield) R25.1
NetD2_1: D2.1 SW_ON.2(CMN) U1.2(~{EN}/OVLO)
NetR9_1: R9.1 R11.2 SW_ON.1
NetR13_2: R13.2 U3.2(ILIM)
NetR17_2: R17.2 U8.6(~{R}D) U9.4(Y)
NetR20_2: R20.2 U5.2(ILIM)

Not connected (* = marked no-connect by the designer): J3 A5(CC1)* B5(CC2)*; SW_ON MT*; U1 6(~{FLT})*; U4 11(TEST)* 18(BC_EN3/PRTPWR3)* 19(OCS_N3)* 20(BC_EN4/PRTPWR4)* 21(OCS_N4)* 28(LOCAL_PWR/NON_REM0/SUSP_IND)*; U8 3(~{Q})*

### Layout directives
differential pair; differential pair class DIFF90: MUX_USB_N, MUX_USB_P, USB_DS1_CON_N, USB_DS1_CON_P, USB_DS1_ESD_N, USB_DS1_ESD_P, USB_DS1_N, USB_DS1_P, USB_DS2_CON_N, USB_DS2_CON_P, USB_DS2_ESD_N, USB_DS2_ESD_P, USB_DS2_N, USB_DS2_P, USB_FPC1_N, USB_FPC1_P, USB_FPC2_N, USB_FPC2_P, USB_HSD1_N, USB_HSD1_P, USB_HSD2_CON_N, USB_HSD2_CON_P, USB_HSD2_ESD_N, USB_HSD2_ESD_P, USB_HSD2_N, USB_HSD2_P
net class USB: (no net found under the mark)

### Notes on the sheet
- TVS diode optional
- (near U1) VIN eFuse
- (near SW_ON) @{"Id":"ZSSJSQPT\DFJGZULC","ObjectType":2}: Slide right to turn on the system
- ca. 3A @ COUT = 100uF. Value should be set experimentally
- ILIM = 3.22A
- USB 2.0 CPU
- USB 2.0 HS Mux
- Power + USB boot
- USB 2.0 DS1
- USB MUX logic table
- SW_UBOOT
- L
- H
- PiMX8_RUN_PG
- Previous state
- HSD2 (U Boot)
- HSD1 (Hub)
- USB CPU
- (near R13) I_max = 500mA
- USB 2.0 HS Hub controller
- USB CPU UBOOT SET & RESET
- USB 2.0 DS2
- (near R20) I_max = 500mA
- Digital logic power
- Termination and pull-up resistors included
- Signal Level Indication
- Border Color = 1.8V
- Border Color = 3.3V
- Border Color = Don´t care
- OV Tech GmbH - Open Visions Technology
- (in symbol CAP_0201_10pF_25V) 0201; C0G
- (in symbol CAP_0402_1.5nF_50V) 0402; C0G
- (in symbol CAP_0402_1µ_25V) 0402; X5R
- (in symbol CAP_0402_4.7µ_6.3V) 0402; X5R
- (in symbol CAP_0402_13pF_50V) 0402; C0G
- (in symbol CAP_0402_100nF_16V) 0402; X7R
- (in symbol CAP_0603_10µ_25V) 0603; X5R
- (in symbol CAP_POLY_100µ_10V) ALU-POLY
- (in symbol RES_0201_510k_1%) 0201
- (in symbol RES_0402_10k_1%) 0402
- (in symbol RES_0402_12k_1%) 0402
- (in symbol RES_0402_33k_1%) 0402
- (in symbol RES_0402_47k_1%) 0402
- (in symbol RES_0402_110k_1%) 0402
- (in symbol RES_0402_330R_1%) 0402
- (in symbol RES_0402_620R_1%) 0402
- (in symbol SW_SLIDE-SWITCH_JS102000SAQN) LEFT; RIGHT; SLIDE
- (in symbol SW_TACTILE_EVQ-P7J01P) TACTILE
- (in symbol USB 2.0 Type-C Receptacle_10151348-00011LF) USB 2.0 Type-C Shielded Receptacle
- (in symbol USB 4-Port USB 2.0 Hi-Speed Hub Controller USB2514B) USB 2.0 HS Hub Controller; Upstream; Downstream 1; Downstream 2; Downstream 3; Downstream 4; EEPROM/Config; Misc; Power
- (in symbol USB Type A - 614104190121) USB A 2.0

### Library data of the parts
?#3 = Titleblock_01_OpenSource
C1 C9 C15 = CAP_POLY_100µ_10V: Aluminium-Polymer capacitor  radial 10VDC; Manufacturer 1: KEMET; Manufacturer 1 Prt. Nr.: A750BK107M1AAAE024
C2 C6 C7 C11-C13 C17-C23 C26 C28 C29 C31-C34 = CAP_0402_100nF_16V: Multilayer Ceramic Capacitors MLCC - SMD/SMT 0402 16VDC; Manufacturer 1: KYOCERA AVX; Manufacturer 1 Prt. Nr.: KGM05AR71C104KH; Manufacturer 2 Prt. Nr.: EMK105B7104KV-F; Manufacturer 2: Taiyo Yuden
C3 C4 C8 C14 = CAP_0603_10µ_25V: Multilayer Ceramic Capacitors MLCC - SMD/SMT 0603 25VDC; Manufacturer 1: Murata Electronics; Manufacturer 1 Prt. Nr.: GRM188R61E106KA73J; Manufacturer 2 Prt. Nr.: CL10A106MA8NRNC; Manufacturer 2: Samsung Electro-Mechanics
C5 = CAP_0402_13pF_50V: Multilayer Ceramic Capacitors MLCC - SMD/SMT 0402 50VDC; Manufacturer 1: Murata Electronics; Manufacturer 1 Prt. Nr.: GRT1555C1H130FA02D; Manufacturer 2 Prt. Nr.: CQ0402FRNPO9BN130; Manufacturer 2: YAGEO
C10 C16 = CAP_0402_1.5nF_50V: Multilayer Ceramic Capacitors MLCC - SMD/SMT 0402 50VDC; Manufacturer 1: Murata Electronics; Manufacturer 1 Prt. Nr.: GRM1555C1H152JA01D; Manufacturer 2 Prt. Nr.: C0402C152J5GACTU; Manufacturer 2: KEMET
C24 C25 = CAP_0201_10pF_25V: Multilayer Ceramic Capacitors MLCC - SMD/SMT 0201 25VDC; Manufacturer 1: Murata Electronics; Manufacturer 1 Prt. Nr.: GJM0335C1E100JB01D; Manufacturer 2 Prt. Nr.: CQ0201JRNPO8BN100; Manufacturer 2: YAGEO
C27 = CAP_0402_4.7µ_6.3V: Multilayer Ceramic Capacitors MLCC - SMD/SMT 0402 6.3VDC; Manufacturer 1: Murata Electronics; Manufacturer 1 Prt. Nr.: GRM155R60J475ME47D; Manufacturer 2 Prt. Nr.: JMK105BC6475MV-F; Manufacturer 2: Taiyo Yuden
C30 = CAP_0402_1µ_25V: Multilayer Ceramic Capacitors MLCC - SMD/SMT 0402 25VDC; Manufacturer 1: Murata Electronics; Manufacturer 1 Prt. Nr.: GRM155R61E105KE11D; Manufacturer 2 Prt. Nr.: 0402X105K250CT; Manufacturer 2: Walsin
D1 D2 = ESD Protection Diode_5.3V_ESD8472MUT5G: ESD Diode Suppressors Bidirectional 5V working voltage X3DFN-2 Package; Manufacturer 1: Onsemi; Manufacturer 1 Prt. Nr.: ESD8472MUT5G
D3-D5 = ESD 5.5V_82400152: WE-TVS TVS Diode – High Speed / Series; Manufacturer 1: Würth Elektronik; Manufacturer 1 Prt. Nr.: 82400152
J3 = USB 2.0 Type-C Receptacle_10151348-00011LF: USB 2.0 C Receptacle Upright Through Hole 14P G/F; Manufacturer 1: Amphenol; Manufacturer 1 Prt. Nr.: 10151348-00011LF
J4 J7 = USB Type A - 614104190121: WR-COM USB 2.0 Type A Horizontal THT Short Type; Manufacturer 1: Würth Elektronik; Manufacturer 1 Prt. Nr.: 614104190121
L1-L3 = Common Mode Choke_744230900: WE-CNSW SMT Common Mode / Line Filter; Manufacturer 1: Würth Elektronik; Manufacturer 1 Prt. Nr.: 744230900
Q1 = N-Channel MOSFET_SSM3K15ACT,L3F: MOSFET 30V SGL N-CH TRENCHMOS Logic Level; Manufacturer 1: Toshiba; Manufacturer 1 Prt. Nr.: SSM3K15ACT,L3F
R9 R11 = RES_0402_47k_1%: Thick Film Resistors - SMD 47k 1%; Manufacturer 1: Vishay / Dale; Manufacturer 1 Prt. Nr.: CRCW040247K0FKEDC; Manufacturer 2 Prt. Nr.: RT0402FRE0747KL; Manufacturer 2: YAGEO
R10 = RES_0402_620R_1%: Thick Film Resistors - SMD 620R 1%; Manufacturer 1: Bourns; Manufacturer 1 Prt. Nr.: CR0402-FX-6200GLF; Manufacturer 2 Prt. Nr.: CRCW0402620RFKTD; Manufacturer 2: Vishay / Dale
R12 R16 R25 = RES_0402_330R_1%: Thick Film Resistors - SMD 330 Ohm 1%; Manufacturer 1: Vishay / Dale; Manufacturer 1 Prt. Nr.: CRCW0402330RFKED; Manufacturer 2 Prt. Nr.: CR0402-FX-3300GLF; Manufacturer 2: Bourns
R13 R20 = RES_0402_110k_1%: Thick Film Resistors - SMD 110k 1%; Manufacturer 1: Würth Elektronik; Manufacturer 1 Prt. Nr.: 560112110186; Manufacturer 2 Prt. Nr.: CR0402-FX-1103GLF; Manufacturer 2: Bourns
R14 R15 R17-R19 R24 = RES_0402_10k_1%: Thick Film Resistors - SMD 10k 1%; Manufacturer 1: Vishay / Dale; Manufacturer 1 Prt. Nr.: CRCW040210K0FKEDC; Manufacturer 2 Prt. Nr.: RT0402FRE0710KL; Manufacturer 2: YAGEO
R21-R23 = RES_0402_33k_1%: Thick Film Resistors - SMD 33k 1%; Manufacturer 1: Vishay / Dale; Manufacturer 1 Prt. Nr.: CRCW040233K0FKEDC; Manufacturer 2 Prt. Nr.: RC0402FR-1333KL; Manufacturer 2: YAGEO
R26 = RES_0201_510k_1%: Thick Film Resistors - SMD 510 kOHM 1%; Manufacturer 1: Yageo; Manufacturer 1 Prt. Nr.: RC0201FR-07510KL; Manufacturer 2 Prt. Nr.: CRCW0201510KFNED; Manufacturer 2: Vishay / Dale
R27 = RES_0402_12k_1%: Thick Film Resistors - SMD 12kOhm 1%; Manufacturer 1: Vishay / Dale; Manufacturer 1 Prt. Nr.: CRCW040212K0FKED; Manufacturer 2 Prt. Nr.: AR0402FR-0712KL; Manufacturer 2: YAGEO
SW1 = SW_TACTILE_EVQ-P7J01P: SMD Switch Tactile SMD 3.2mm X 2.9mm; Manufacturer 1: Panasonic; Manufacturer 1 Prt. Nr.: EVQ-P7J01P
SW_ON = SW_SLIDE-SWITCH_JS102000SAQN: Sub-Miniature Slide Switch JS102000SAQN; Manufacturer 1: C&K Switches; Manufacturer 1 Prt. Nr.: JS102000SAQN
U1 = 5V 4A eFuse_TPS259533DSG: PS2595xx 2.7 V to 18 V, 4-A, 34-mΩ eFuse With Fast Overvoltage Protection; Manufacturer 1: Texas Instruments; Manufacturer 1 Prt. Nr.: TPS259533DSG
U2 = USB Switch_FSUSB42UMX: Low-Power, Two-Port, High-Speed, USB2.0 (480Mbps) UART Switch; Manufacturer 1: ONSEMI; Manufacturer 1 Prt. Nr.: FSUSB42UMX
U3 U5 = Power Switch with programmable current limit TPS25221DRVR: 0.275-2.7A adj. ILIMIT, 2.5-5.5V, 70mΩ USB power switch, active-high, reverse blocking; Manufacturer 1: Texas Instruments; Manufacturer 1 Prt. Nr.: TPS25221DRVR
U4 = USB 4-Port USB 2.0 Hi-Speed Hub Controller USB2514B: 4-Port USB 2.0 Hi-Speed Hub Controller; Manufacturer 1: Microchip; Manufacturer 1 Prt. Nr.: USB2514B-I/M2
U8 = D-FLOP_SMG-W-2,0x1,2x1,25-AU: D-type flip-flop with differential output and async set- and reset input; Manufacturer 1: Nexperia; Manufacturer 1 Prt. Nr.: 74AUP1G74GT,115
U9 = Inverter_74AUP1G14GM,115: Single Unbuffered Inverter 74AUP1G14GM,115; Manufacturer 1: Nexperia; Manufacturer 1 Prt. Nr.: 74AUP1G14GM,115
XTAL1 = Crystal_ECX-1637B_24MHz: SMD Crystal 24 MHz 12pF; Manufacturer 1: ECS; Manufacturer 1 Prt. Nr.: ECS-240-12-37B-CKY-TR

## Sheet 05_FPC_DB.SchDoc: FPC Connector
size 420 x 297 mm; Author: T. Ludemann; SheetNumber: 5; SheetTotal: 8; DocSize: DINA3
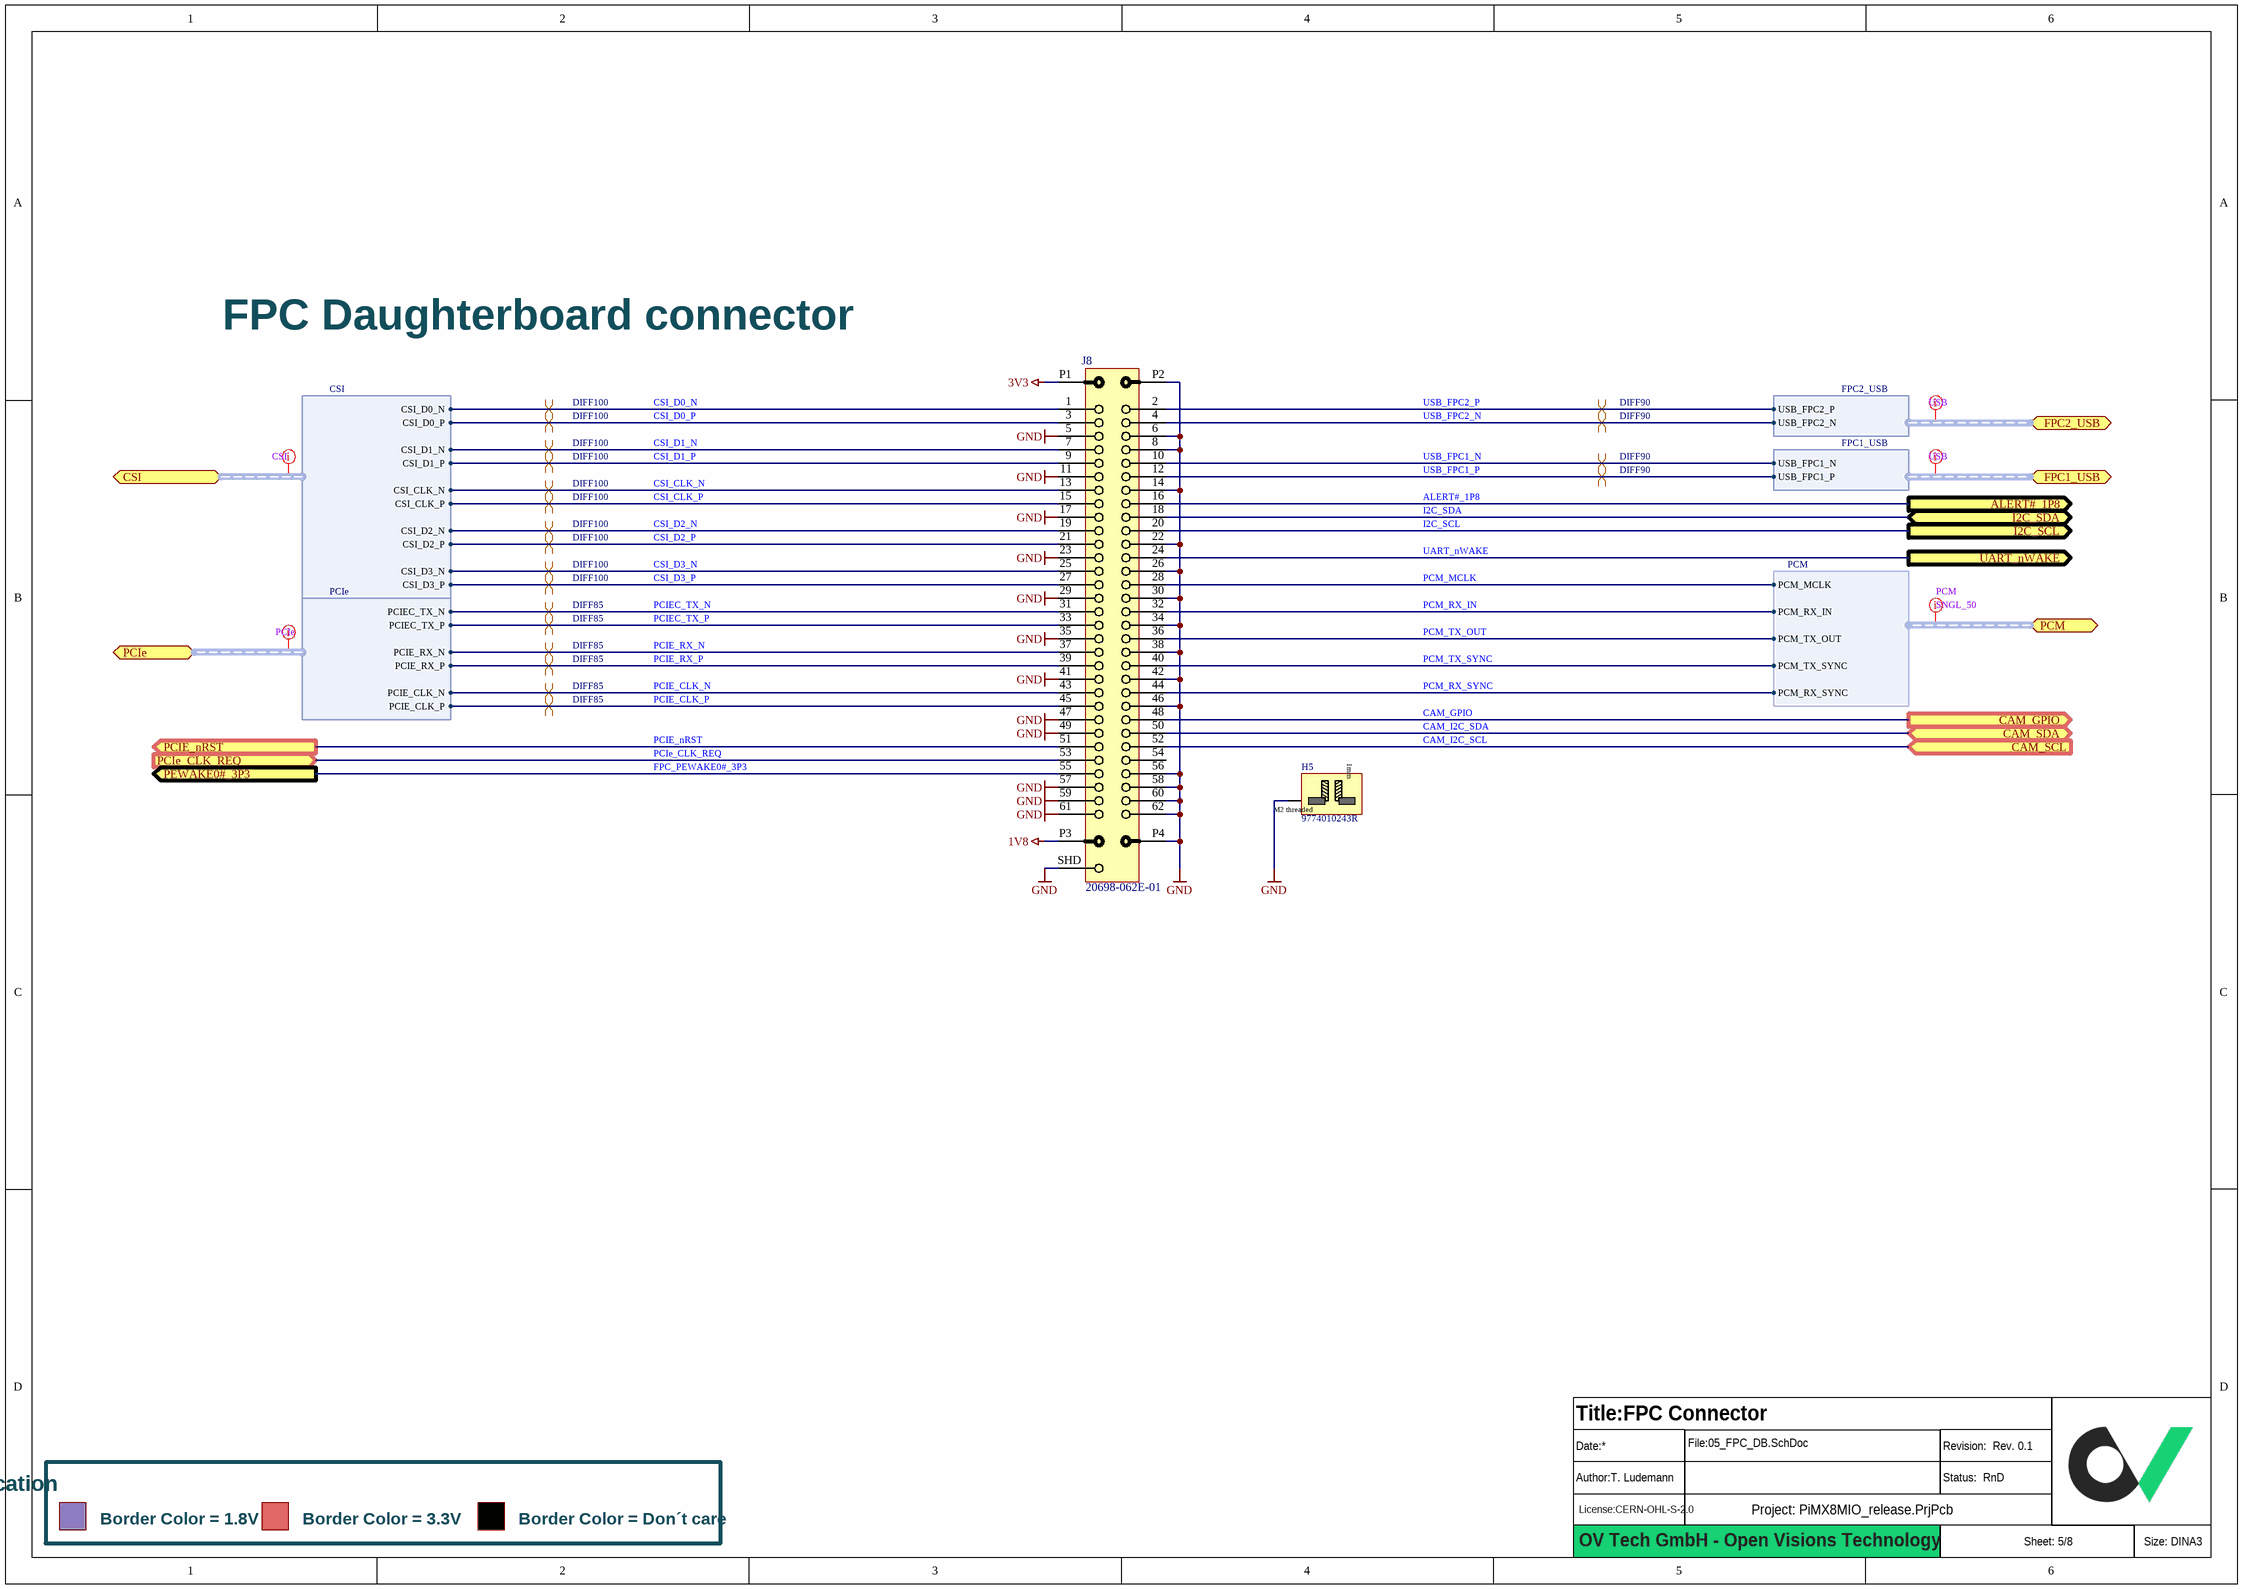
[diagram p6: 05_FPC_DB.SchDoc]

### Parts
(Parts that share a designator on the sheet are numbered #1, #2 ... from top to bottom, then left to right.)
?#4  (no value)  (graphical)
H5  9774010243R  [Spacer_SMD_M2x1_9774010243R]
J8  20698-062E-01  [BOARD-TO-BOARD 62POL_20698-062E-01]

### Ports
ALERT#_1P8 (out), CAM_GPIO (out), CAM_SCL (in), CAM_SDA (bidir), CSI (bidir, harness CSI), FPC1_USB (bidir, harness FPC1_USB), FPC2_USB (bidir, harness FPC2_USB), I2C_SCL (out), I2C_SDA (bidir), PCIe (bidir, harness PCIe), PCIe_CLK_REQ (in), PCIE_nRST (out), PCM (bidir, harness PCM), PEWAKE0#_3P3 (out), UART_nWAKE (out)

### Harnesses
CSI: CSI_D0_N, CSI_D0_P, CSI_D1_N, CSI_D1_P, CSI_CLK_N, CSI_CLK_P, CSI_D2_N, CSI_D2_P, CSI_D3_N, CSI_D3_P
PCIe: PCIE_CLK_N, PCIE_CLK_P, PCIEC_TX_N, PCIE_RX_P, PCIE_RX_N, PCIEC_TX_P
FPC1_USB: USB_FPC1_P, USB_FPC1_N
FPC2_USB: USB_FPC2_P, USB_FPC2_N
PCM: PCM_MCLK, PCM_TX_OUT, PCM_RX_IN, PCM_TX_SYNC, PCM_RX_SYNC

### Nets
1V8: J8.P3
3V3: J8.P1
GND: H5.MT J8.5 J8.6 J8.8 J8.11 J8.14 J8.17 J8.22 J8.23 J8.26 J8.29 J8.30 J8.34 J8.35 J8.38 J8.41 J8.42 J8.46 J8.47 J8.49 J8.56 J8.57 J8.58 J8.59 J8.60 J8.61 J8.62 J8.P2 J8.P4 J8.SHD
ALERT#_1P8: J8.16 ; port ALERT#_1P8
CAM_GPIO: J8.48 ; port CAM_GPIO
CAM_I2C_SCL: J8.52 ; port CAM_SCL
CAM_I2C_SDA: J8.50 ; port CAM_SDA
CSI_CLK_N: J8.13 ; port CSI.CSI_CLK_N
CSI_CLK_P: J8.15 ; port CSI.CSI_CLK_P
CSI_D0_N: J8.1 ; port CSI.CSI_D0_N
CSI_D0_P: J8.3 ; port CSI.CSI_D0_P
CSI_D1_N: J8.7 ; port CSI.CSI_D1_N
CSI_D1_P: J8.9 ; port CSI.CSI_D1_P
CSI_D2_N: J8.19 ; port CSI.CSI_D2_N
CSI_D2_P: J8.21 ; port CSI.CSI_D2_P
CSI_D3_N: J8.25 ; port CSI.CSI_D3_N
CSI_D3_P: J8.27 ; port CSI.CSI_D3_P
FPC_PEWAKE0#_3P3: J8.55 ; port PEWAKE0#_3P3
I2C_SCL: J8.20 ; port I2C_SCL
I2C_SDA: J8.18 ; port I2C_SDA
PCIE_CLK_N: J8.43 ; port PCIe.PCIE_CLK_N
PCIE_CLK_P: J8.45 ; port PCIe.PCIE_CLK_P
PCIe_CLK_REQ: J8.53 ; port PCIe_CLK_REQ
PCIE_nRST: J8.51 ; port PCIE_nRST
PCIE_RX_N: J8.37 ; port PCIe.PCIE_RX_N
PCIE_RX_P: J8.39 ; port PCIe.PCIE_RX_P
PCIEC_TX_N: J8.31 ; port PCIe.PCIEC_TX_N
PCIEC_TX_P: J8.33 ; port PCIe.PCIEC_TX_P
PCM_MCLK: J8.28 ; port PCM.PCM_MCLK
PCM_RX_IN: J8.32 ; port PCM.PCM_RX_IN
PCM_RX_SYNC: J8.44 ; port PCM.PCM_RX_SYNC
PCM_TX_OUT: J8.36 ; port PCM.PCM_TX_OUT
PCM_TX_SYNC: J8.40 ; port PCM.PCM_TX_SYNC
UART_nWAKE: J8.24 ; port UART_nWAKE
USB_FPC1_N: J8.10 ; port FPC1_USB.USB_FPC1_N
USB_FPC1_P: J8.12 ; port FPC1_USB.USB_FPC1_P
USB_FPC2_N: J8.4 ; port FPC2_USB.USB_FPC2_N
USB_FPC2_P: J8.2 ; port FPC2_USB.USB_FPC2_P

Not connected (* = marked no-connect by the designer): J8 54

### Layout directives
net class CSI: (no net found under the mark)
differential pair; differential pair class DIFF100: CSI_CLK_N, CSI_CLK_P, CSI_D0_N, CSI_D0_P, CSI_D1_N, CSI_D1_P, CSI_D2_N, CSI_D2_P, CSI_D3_N, CSI_D3_P
net class PCIe: (no net found under the mark)
differential pair; differential pair class DIFF85: PCIE_CLK_N, PCIE_CLK_P, PCIE_RX_N, PCIE_RX_P, PCIEC_TX_N, PCIEC_TX_P
net class USB: (no net found under the mark)
differential pair; differential pair class DIFF90: USB_FPC1_N, USB_FPC1_P, USB_FPC2_N, USB_FPC2_P
net class PCM; net class SNGL_50: (no net found under the mark)

### Notes on the sheet
- (near J8) FPC Daughterboard connector
- Signal Level Indication
- Border Color = 1.8V
- Border Color = 3.3V
- Border Color = Don´t care
- OV Tech GmbH - Open Visions Technology
- (in symbol Spacer_SMD_M2_internal_1mm) 1mm; M2 threaded

### Library data of the parts
?#4 = Titleblock_01_OpenSource
H5 = Spacer_SMD_M2_internal_1mm: Würth Elektronik SMD Spacer M2 1mm length; Manufacturer 1: Würth Elektronik; Manufacturer 1 Prt. Nr.: 9774010243R
J8 = Board to Board Connector_62pol_20698-062E-01: Board to Board connector 62Pol FPC Header 0.35mm Pitch; Manufacturer 1: I-PEX; Manufacturer 1 Prt. Nr.: 20698-062E-01

## Sheet 06_SD_CARD.SchDoc: SD Card
size 420 x 297 mm; Author: T. Ludemann; SheetNumber: 6; SheetTotal: 8; DocSize: DINA3
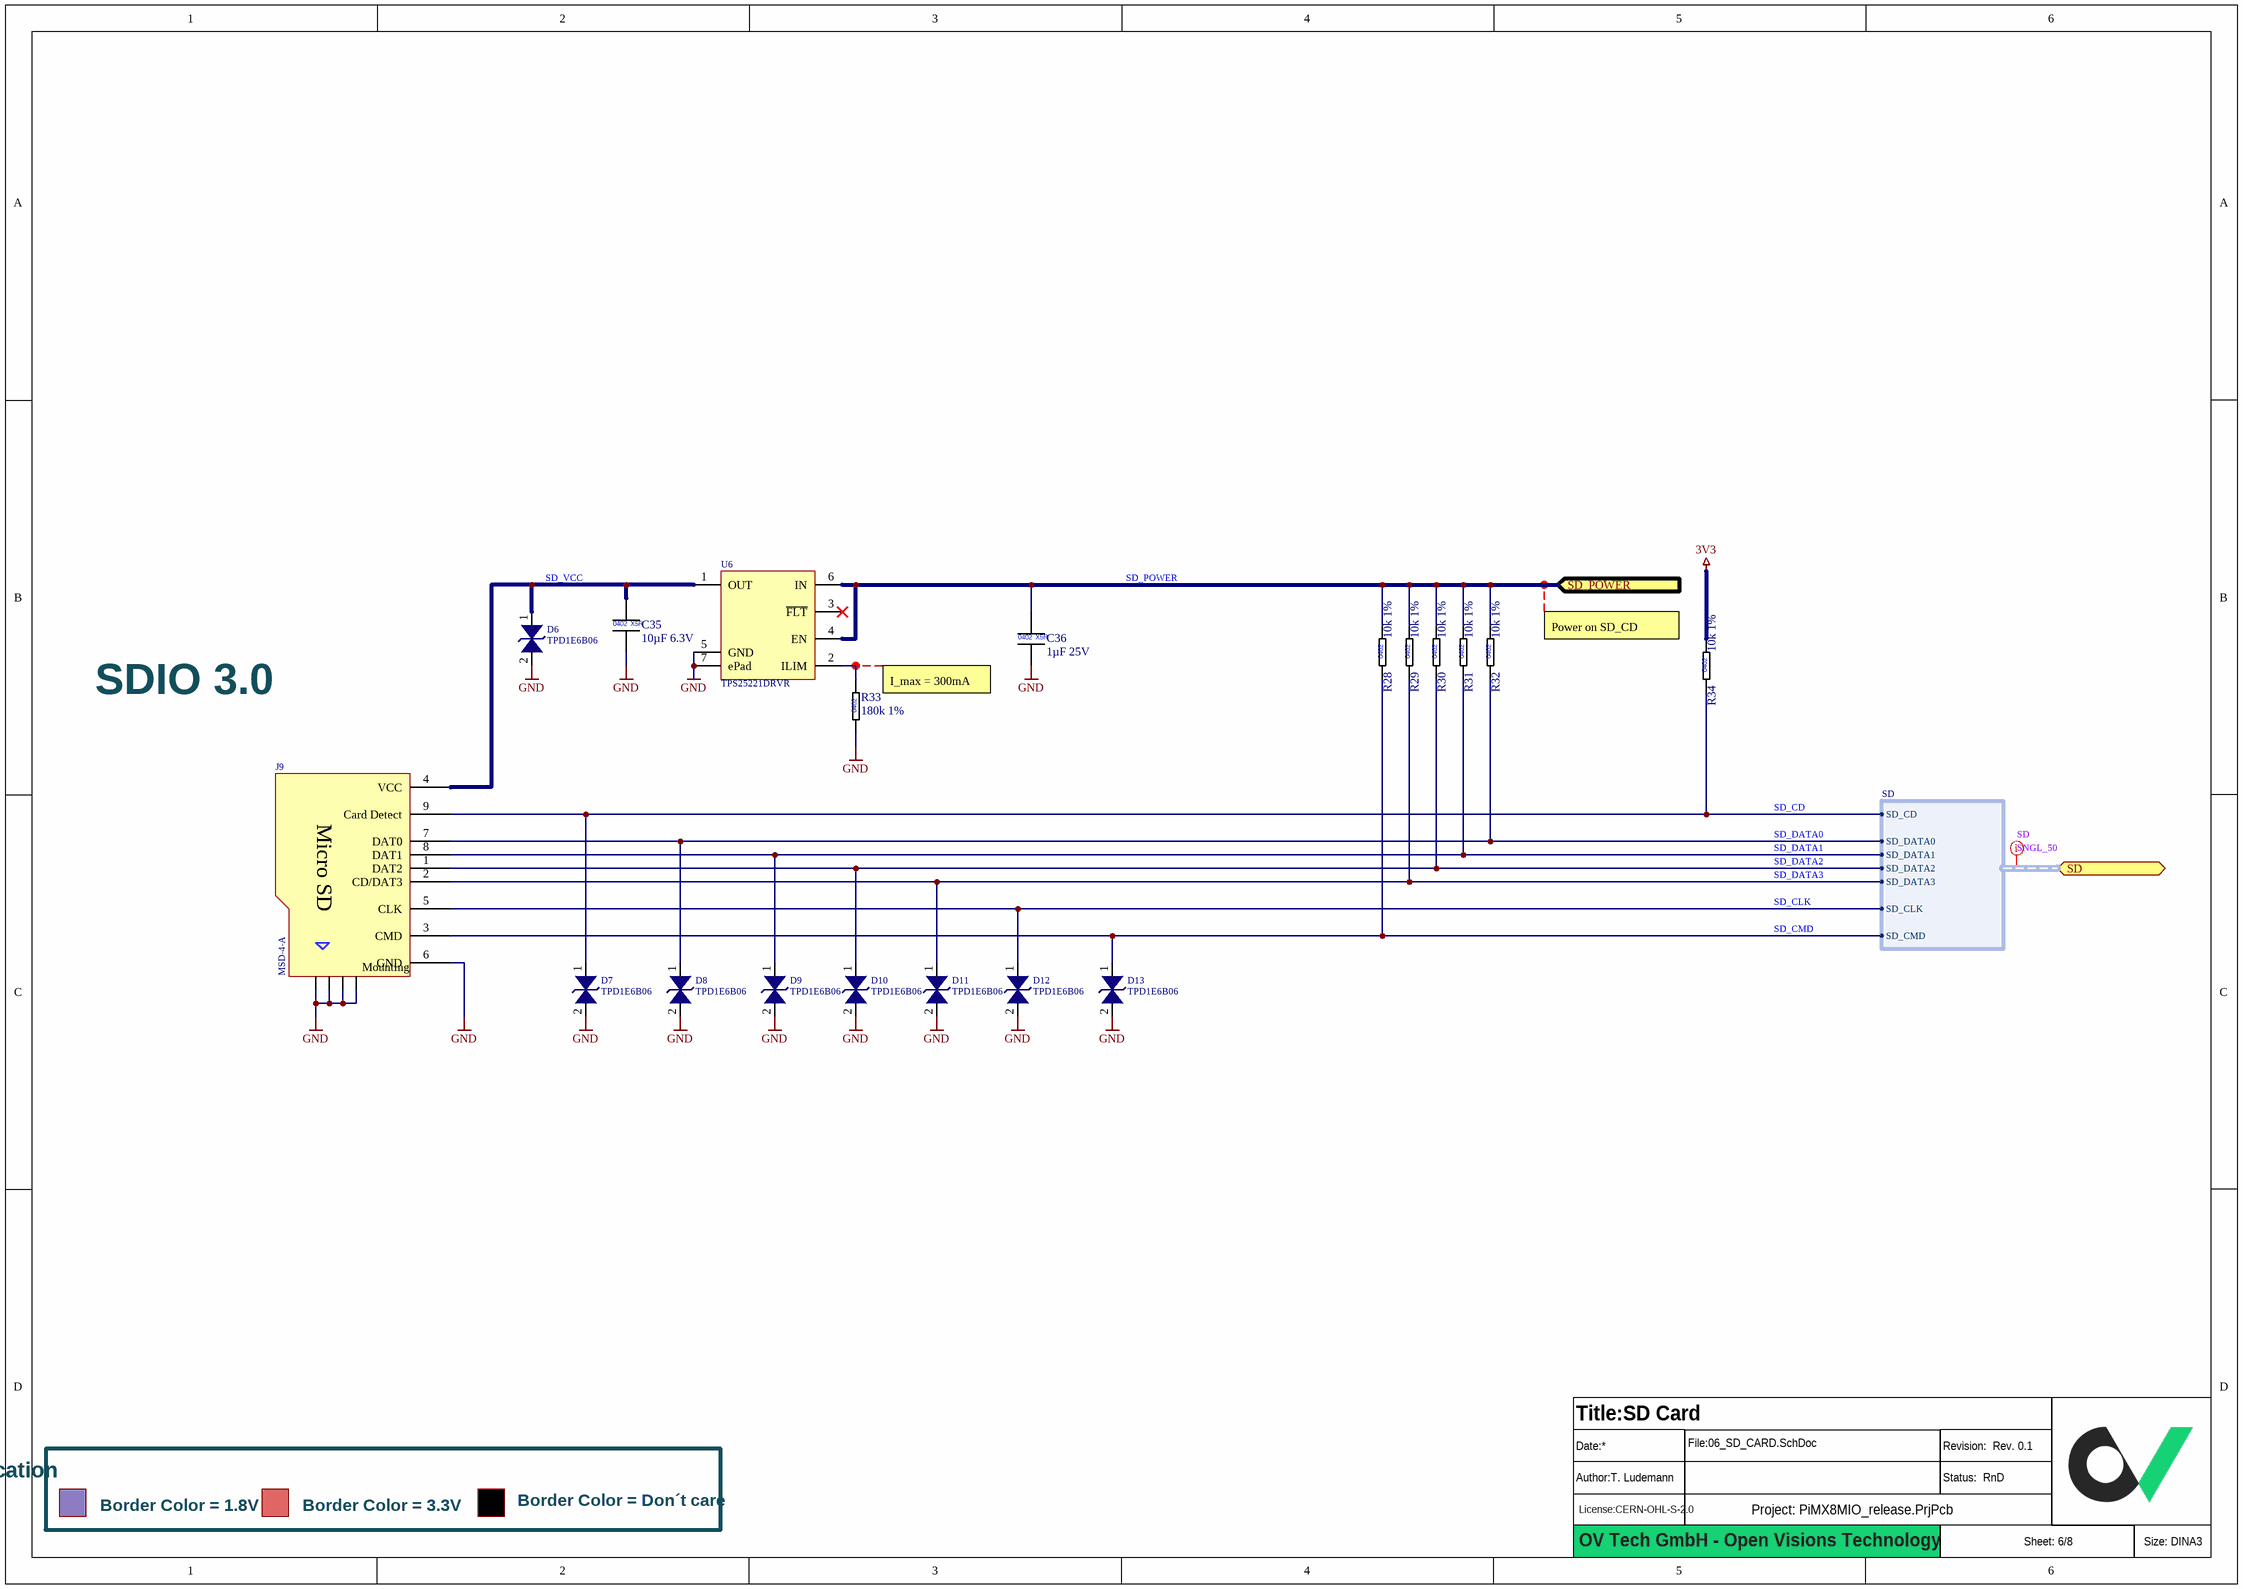
[diagram p7: 06_SD_CARD.SchDoc]

### Parts
(Parts that share a designator on the sheet are numbered #1, #2 ... from top to bottom, then left to right.)
?#5  (no value)  (graphical)
C35  10µF 6.3V  [CAPC1005X06L]
C36  1µF 25V  [CAPC1005X06L]
D6  TPD1E6B06  [DFN38P60X29-2L]
D7  TPD1E6B06  [DFN38P60X29-2L]
D8  TPD1E6B06  [DFN38P60X29-2L]
D9  TPD1E6B06  [DFN38P60X29-2L]
D10  TPD1E6B06  [DFN38P60X29-2L]
D11  TPD1E6B06  [DFN38P60X29-2L]
D12  TPD1E6B06  [DFN38P60X29-2L]
D13  TPD1E6B06  [DFN38P60X29-2L]
J9  MSD-4-A  [MicroSD Connector_MSD-4-A]
R28  10k 1%  [RESC1005X04L]
R29  10k 1%  [RESC1005X04L]
R30  10k 1%  [RESC1005X04L]
R31  10k 1%  [RESC1005X04L]
R32  10k 1%  [RESC1005X04L]
R33  180k 1%  [RESC1005X04L]
R34  10k 1%  [RESC1005X04L]
U6  TPS25221DRVR  [SON65P200X80_HS-7N]

### Ports
SD (bidir, harness SD), SD_POWER (in)

### Harnesses
SD: SD_CLK, SD_CMD, SD_CD, SD_DATA0, SD_DATA1, SD_DATA2, SD_DATA3

### Nets
3V3: R34.2
GND: C35.2 C36.2 D6.2 D7.2 D8.2 D9.2 D10.2 D11.2 D12.2 D13.2 J9.6(GND) J9.10 J9.11 J9.12 J9.13 R33.1 U6.5(GND) U6.7(ePad)
SD_CD: D7.1 J9.9(Card_Detect) R34.1 ; port SD.SD_CD
SD_CLK: D12.1 J9.5(CLK) ; port SD.SD_CLK
SD_CMD: D13.1 J9.3(CMD) R28.1 ; port SD.SD_CMD
SD_DATA0: D8.1 J9.7(DAT0) R32.1 ; port SD.SD_DATA0
SD_DATA1: D9.1 J9.8(DAT1) R31.1 ; port SD.SD_DATA1
SD_DATA2: D10.1 J9.1(DAT2) R30.1 ; port SD.SD_DATA2
SD_DATA3: D11.1 J9.2(CD/DAT3) R29.1 ; port SD.SD_DATA3
SD_POWER: C36.1 R28.2 R29.2 R30.2 R31.2 R32.2 U6.4(EN) U6.6(IN) ; port SD_POWER
SD_VCC: C35.1 D6.1 J9.4(VCC) U6.1(OUT)
NetR33_2: R33.2 U6.2(ILIM)

Not connected (* = marked no-connect by the designer): U6 3(~{FLT})*

### Layout directives
net class SD; net class SNGL_50: (no net found under the mark)

### Notes on the sheet
- (near R34) Power on SD_CD
- SDIO 3.0
- (near R33) I_max = 300mA
- Signal Level Indication
- Border Color = 1.8V
- Border Color = 3.3V
- Border Color = Don´t care
- OV Tech GmbH - Open Visions Technology
- (in symbol CAP_0402_1µ_25V) 0402; X5R
- (in symbol CAP_0402_10µ_6.3V) 0402; X5R
- (in symbol Micro SD Connector_MSD-4-A) Micro SD; Mounting
- (in symbol RES_0402_10k_1%) 0402
- (in symbol RES_0402_180k_1%) 0402

### Library data of the parts
?#5 = Titleblock_01_OpenSource
C35 = CAP_0402_10µ_6.3V: Multilayer Ceramic Capacitors MLCC - SMD/SMT 0402 6.3VDC; Manufacturer 1: Murata Electronics; Manufacturer 1 Prt. Nr.: GRM155C80J106ME11J; Manufacturer 2 Prt. Nr.: JMK105CBJ106MV-F; Manufacturer 2: Taiyo Yuden
C36 = CAP_0402_1µ_25V: as C30 on sheet 04_USB_PWR; Manufacturer 2: Walsin
D6-D13 = ESD Protection Diode_3.6V_TPD1E6B06: 6pF ±5V ±15kV ESD protection diode in 0201 package; Manufacturer 1: Texas Instruments; Manufacturer 1 Prt. Nr.: TPD1E6B06
J9 = Micro SD Connector_MSD-4-A: Micro SD Card Connector, 9 Positions, Connector and Ejector, Push In, Auto Eject Out, Surface Mount, 1.8 mm Height Above Board, Gold Flash; Manufacturer 1: XUNPU; Manufacturer 1 Prt. Nr.: TF-115
R28-R32 R34 = RES_0402_10k_1%: as R14 on sheet 04_USB_PWR; Manufacturer 2: YAGEO
R33 = RES_0402_180k_1%: Thick Film Resistors - SMD 180k 1%; Manufacturer 1: Bourns; Manufacturer 1 Prt. Nr.: CR0402-JW-184GLF; Manufacturer 2 Prt. Nr.: CRGCQ0402F180K; Manufacturer 2: TE Connectivity / Holsworthy
U6 = Power Switch with programmable current limit TPS25221DRVR: as U3 on sheet 04_USB_PWR; Manufacturer 1 Prt. Nr.: TPS25221DRVR

## Sheet 07_HDMI.SchDoc: HMDI
size 420 x 297 mm; Author: T. Ludemann; SheetNumber: 7; SheetTotal: 8; DocSize: DINA3
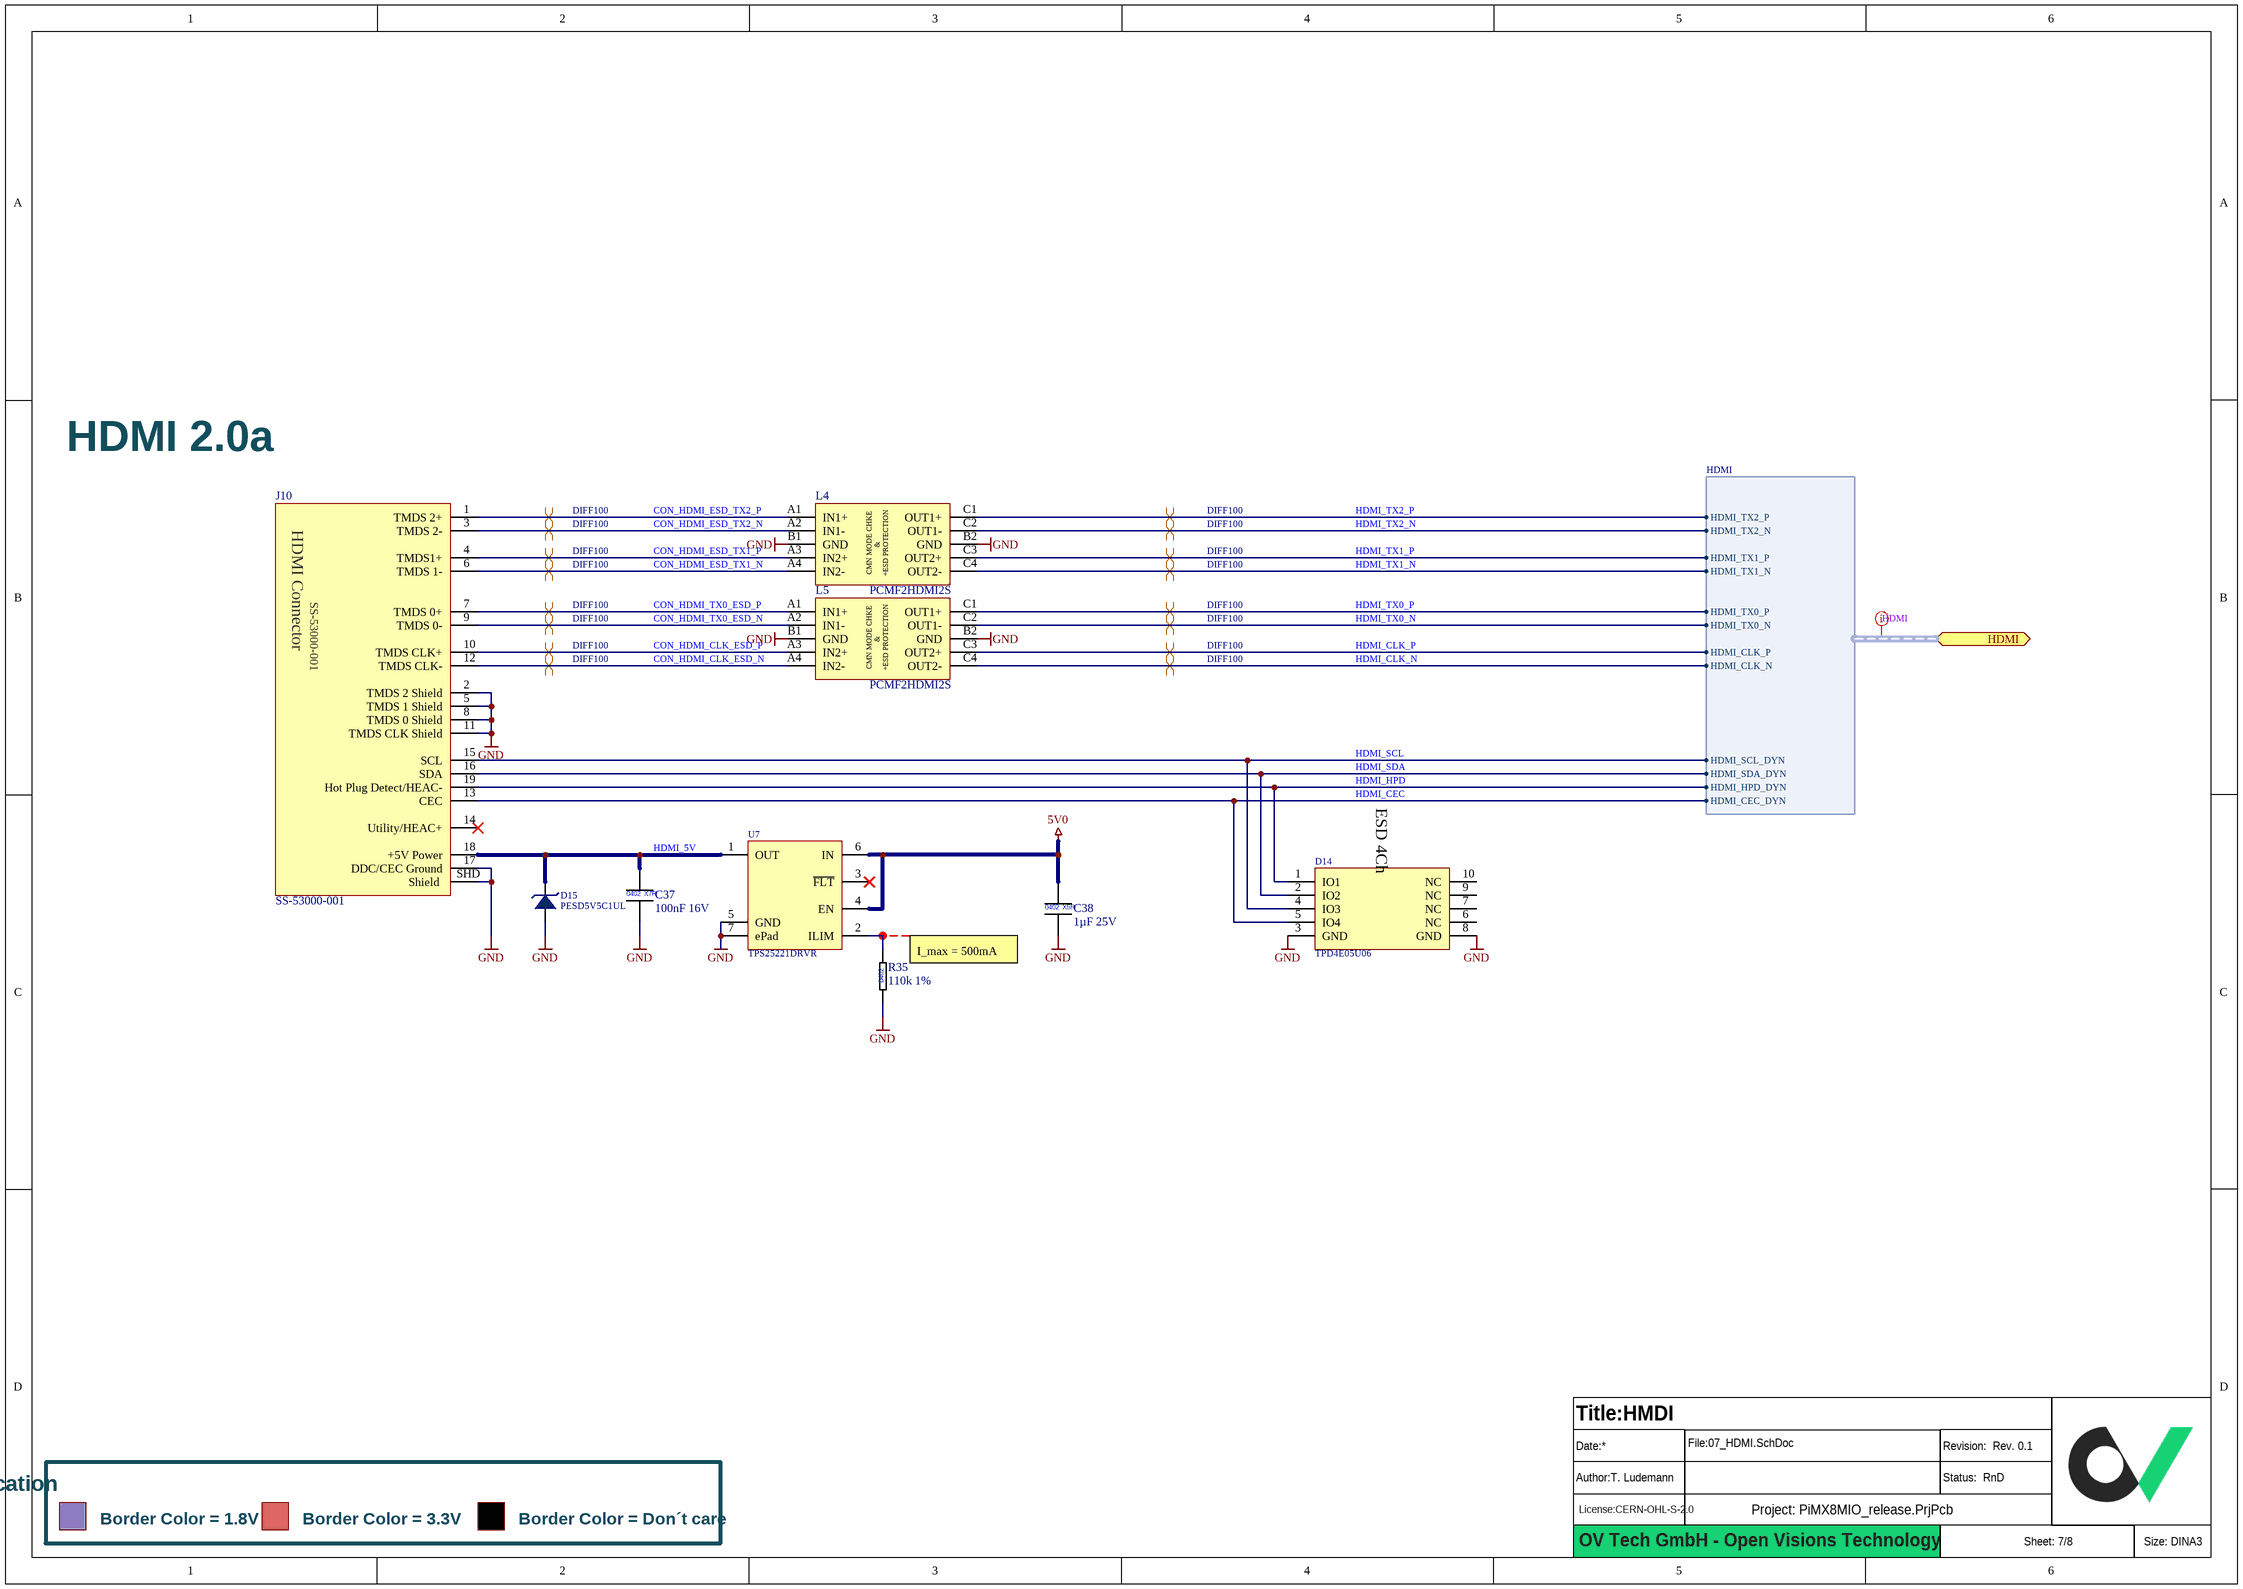
[diagram p8: 07_HDMI.SchDoc]

### Parts
(Parts that share a designator on the sheet are numbered #1, #2 ... from top to bottom, then left to right.)
?#6  (no value)  (graphical)
C37  100nF 16V  [CAPC1005X06L]
C38  1µF 25V  [CAPC1005X06L]
D14  TPD4E05U06  [TI_DQA_10_Pin]
D15  PESD5V5C1UL  [DFN65P100X50-2N]
J10  SS-53000-001  [HDMI-1.4_SS-53000-001]
L4  PCMF2HDMI2S  [Nexperia_PCMF2HDMI2S]
L5  PCMF2HDMI2S  [Nexperia_PCMF2HDMI2S]
R35  110k 1%  [RESC1005X04L]
U7  TPS25221DRVR  [SON65P200X80_HS-7N]

### Ports
HDMI (bidir, harness HDMI)

### Harnesses
HDMI: HDMI_SCL_DYN, HDMI_SDA_DYN, HDMI_HPD_DYN, HDMI_CEC_DYN, HDMI_CLK_N, HDMI_CLK_P, HDMI_TX0_N, HDMI_TX0_P, HDMI_TX1_N, HDMI_TX1_P, HDMI_TX2_N, HDMI_TX2_P

### Nets
5V0: C38.1 U7.4(EN) U7.6(IN)
GND: C37.2 C38.2 D14.3(GND) D14.8(GND) D15.2 J10.2(TMDS_2_Shield) J10.5(TMDS_1_Shield) J10.8(TMDS_0_Shield) J10.11(TMDS_CLK_Shield) J10.17(DDC/CEC_Ground) J10.SHD(Shield) L4.B1(GND) L4.B2(GND) L5.B1(GND) L5.B2(GND) R35.1 U7.5(GND) U7.7(ePad)
CON_HDMI_CLK_ESD_N: J10.12(TMDS_CLK-) L5.A4(IN2-)
CON_HDMI_CLK_ESD_P: J10.10(TMDS_CLK+) L5.A3(IN2+)
CON_HDMI_ESD_TX1_N: J10.6(TMDS_1-) L4.A4(IN2-)
CON_HDMI_ESD_TX1_P: J10.4(TMDS1+) L4.A3(IN2+)
CON_HDMI_ESD_TX2_N: J10.3(TMDS_2-) L4.A2(IN1-)
CON_HDMI_ESD_TX2_P: J10.1(TMDS_2+) L4.A1(IN1+)
CON_HDMI_TX0_ESD_N: J10.9(TMDS_0-) L5.A2(IN1-)
CON_HDMI_TX0_ESD_P: J10.7(TMDS_0+) L5.A1(IN1+)
HDMI_5V: C37.1 D15.1 J10.18(+5V_Power) U7.1(OUT)
HDMI_CEC: D14.5(IO4) J10.13(CEC) ; port HDMI.HDMI_CEC_DYN
HDMI_CLK_N: L5.C4(OUT2-) ; port HDMI.HDMI_CLK_N
HDMI_CLK_P: L5.C3(OUT2+) ; port HDMI.HDMI_CLK_P
HDMI_HPD: D14.1(IO1) J10.19(Hot_Plug_Detect/HEAC-) ; port HDMI.HDMI_HPD_DYN
HDMI_SCL: D14.4(IO3) J10.15(SCL) ; port HDMI.HDMI_SCL_DYN
HDMI_SDA: D14.2(IO2) J10.16(SDA) ; port HDMI.HDMI_SDA_DYN
HDMI_TX0_N: L5.C2(OUT1-) ; port HDMI.HDMI_TX0_N
HDMI_TX0_P: L5.C1(OUT1+) ; port HDMI.HDMI_TX0_P
HDMI_TX1_N: L4.C4(OUT2-) ; port HDMI.HDMI_TX1_N
HDMI_TX1_P: L4.C3(OUT2+) ; port HDMI.HDMI_TX1_P
HDMI_TX2_N: L4.C2(OUT1-) ; port HDMI.HDMI_TX2_N
HDMI_TX2_P: L4.C1(OUT1+) ; port HDMI.HDMI_TX2_P
NetR35_2: R35.2 U7.2(ILIM)

Not connected (* = marked no-connect by the designer): D14 6(NC) 7(NC) 9(NC) 10(NC); J10 14(Utility/HEAC+)*; U7 3(~{FLT})*

### Layout directives
net class HDMI: (no net found under the mark)
differential pair; differential pair class DIFF100: CON_HDMI_CLK_ESD_N, CON_HDMI_CLK_ESD_P, CON_HDMI_ESD_TX1_N, CON_HDMI_ESD_TX1_P, CON_HDMI_ESD_TX2_N, CON_HDMI_ESD_TX2_P, CON_HDMI_TX0_ESD_N, CON_HDMI_TX0_ESD_P, HDMI_CLK_N, HDMI_CLK_P, HDMI_TX0_N, HDMI_TX0_P, HDMI_TX1_N, HDMI_TX1_P, HDMI_TX2_N, HDMI_TX2_P

### Notes on the sheet
- HDMI 2.0a
- (near R35) I_max = 500mA
- Signal Level Indication
- Border Color = 1.8V
- Border Color = 3.3V
- Border Color = Don´t care
- OV Tech GmbH - Open Visions Technology
- (in symbol CAP_0402_1µ_25V) 0402; X5R
- (in symbol CAP_0402_100nF_16V) 0402; X7R
- (in symbol Common Mode Choke 2 Channel with ESD prot_PCMF2HDMI2S) &; CMN MODE CHKE; +ESD PROTECTION
- (in symbol ESD_HI-SPEED_ARRAY_TPD4E05U06) ESD 4Ch
- (in symbol HDMI Receptacle_SS-53000-001) HDMI Connector
- (in symbol RES_0402_110k_1%) 0402

### Library data of the parts
?#6 = Titleblock_01_OpenSource
C37 = CAP_0402_100nF_16V: as C2 on sheet 04_USB_PWR; Manufacturer 2: Taiyo Yuden
C38 = CAP_0402_1µ_25V: as C30 on sheet 04_USB_PWR; Manufacturer 2: Walsin
D14 = ESD_HI-SPEED_ARRAY_TPD4E05U06: PDxE05U06 1, 4, 6 Channel ESD Protection Device for Super-Speed (Up to 6 Gbps) Interface; Manufacturer 1: Texas Instruments; Manufacturer 1 Prt. Nr.: TPD4E05U06
D15 = ESD 5.5V_PESD5V5C1UL: ESD Diode 5.5V working voltage DFN1006-2; Manufacturer 1: Nexperia; Manufacturer 1 Prt. Nr.: PESD5V5C1UL
J10 = HDMI Receptacle_SS-53000-001: CONN RCPT HDMI 1.4 R/A NO FLANGE; Manufacturer 1: Stewart Connector; Manufacturer 1 Prt. Nr.: SS-53000-001
L4 L5 = Common Mode Choke 2 Channel with ESD prot_PCMF2HDMI2S: Common-mode EMI filter for differential channels with / integrated ESD protection; Manufacturer 1: Nexperia; Manufacturer 1 Prt. Nr.: PCMF2HDMI2S
R35 = RES_0402_110k_1%: as R13 on sheet 04_USB_PWR; Manufacturer 2: Bourns
U7 = Power Switch with programmable current limit TPS25221DRVR: as U3 on sheet 04_USB_PWR; Manufacturer 1 Prt. Nr.: TPS25221DRVR

## Sheet 08_GBIT_ETHERNET.SchDoc: Gigabit Ethernet
size 420 x 297 mm; Author: T. Ludemann; SheetNumber: 8; SheetTotal: 8; DocSize: DINA3
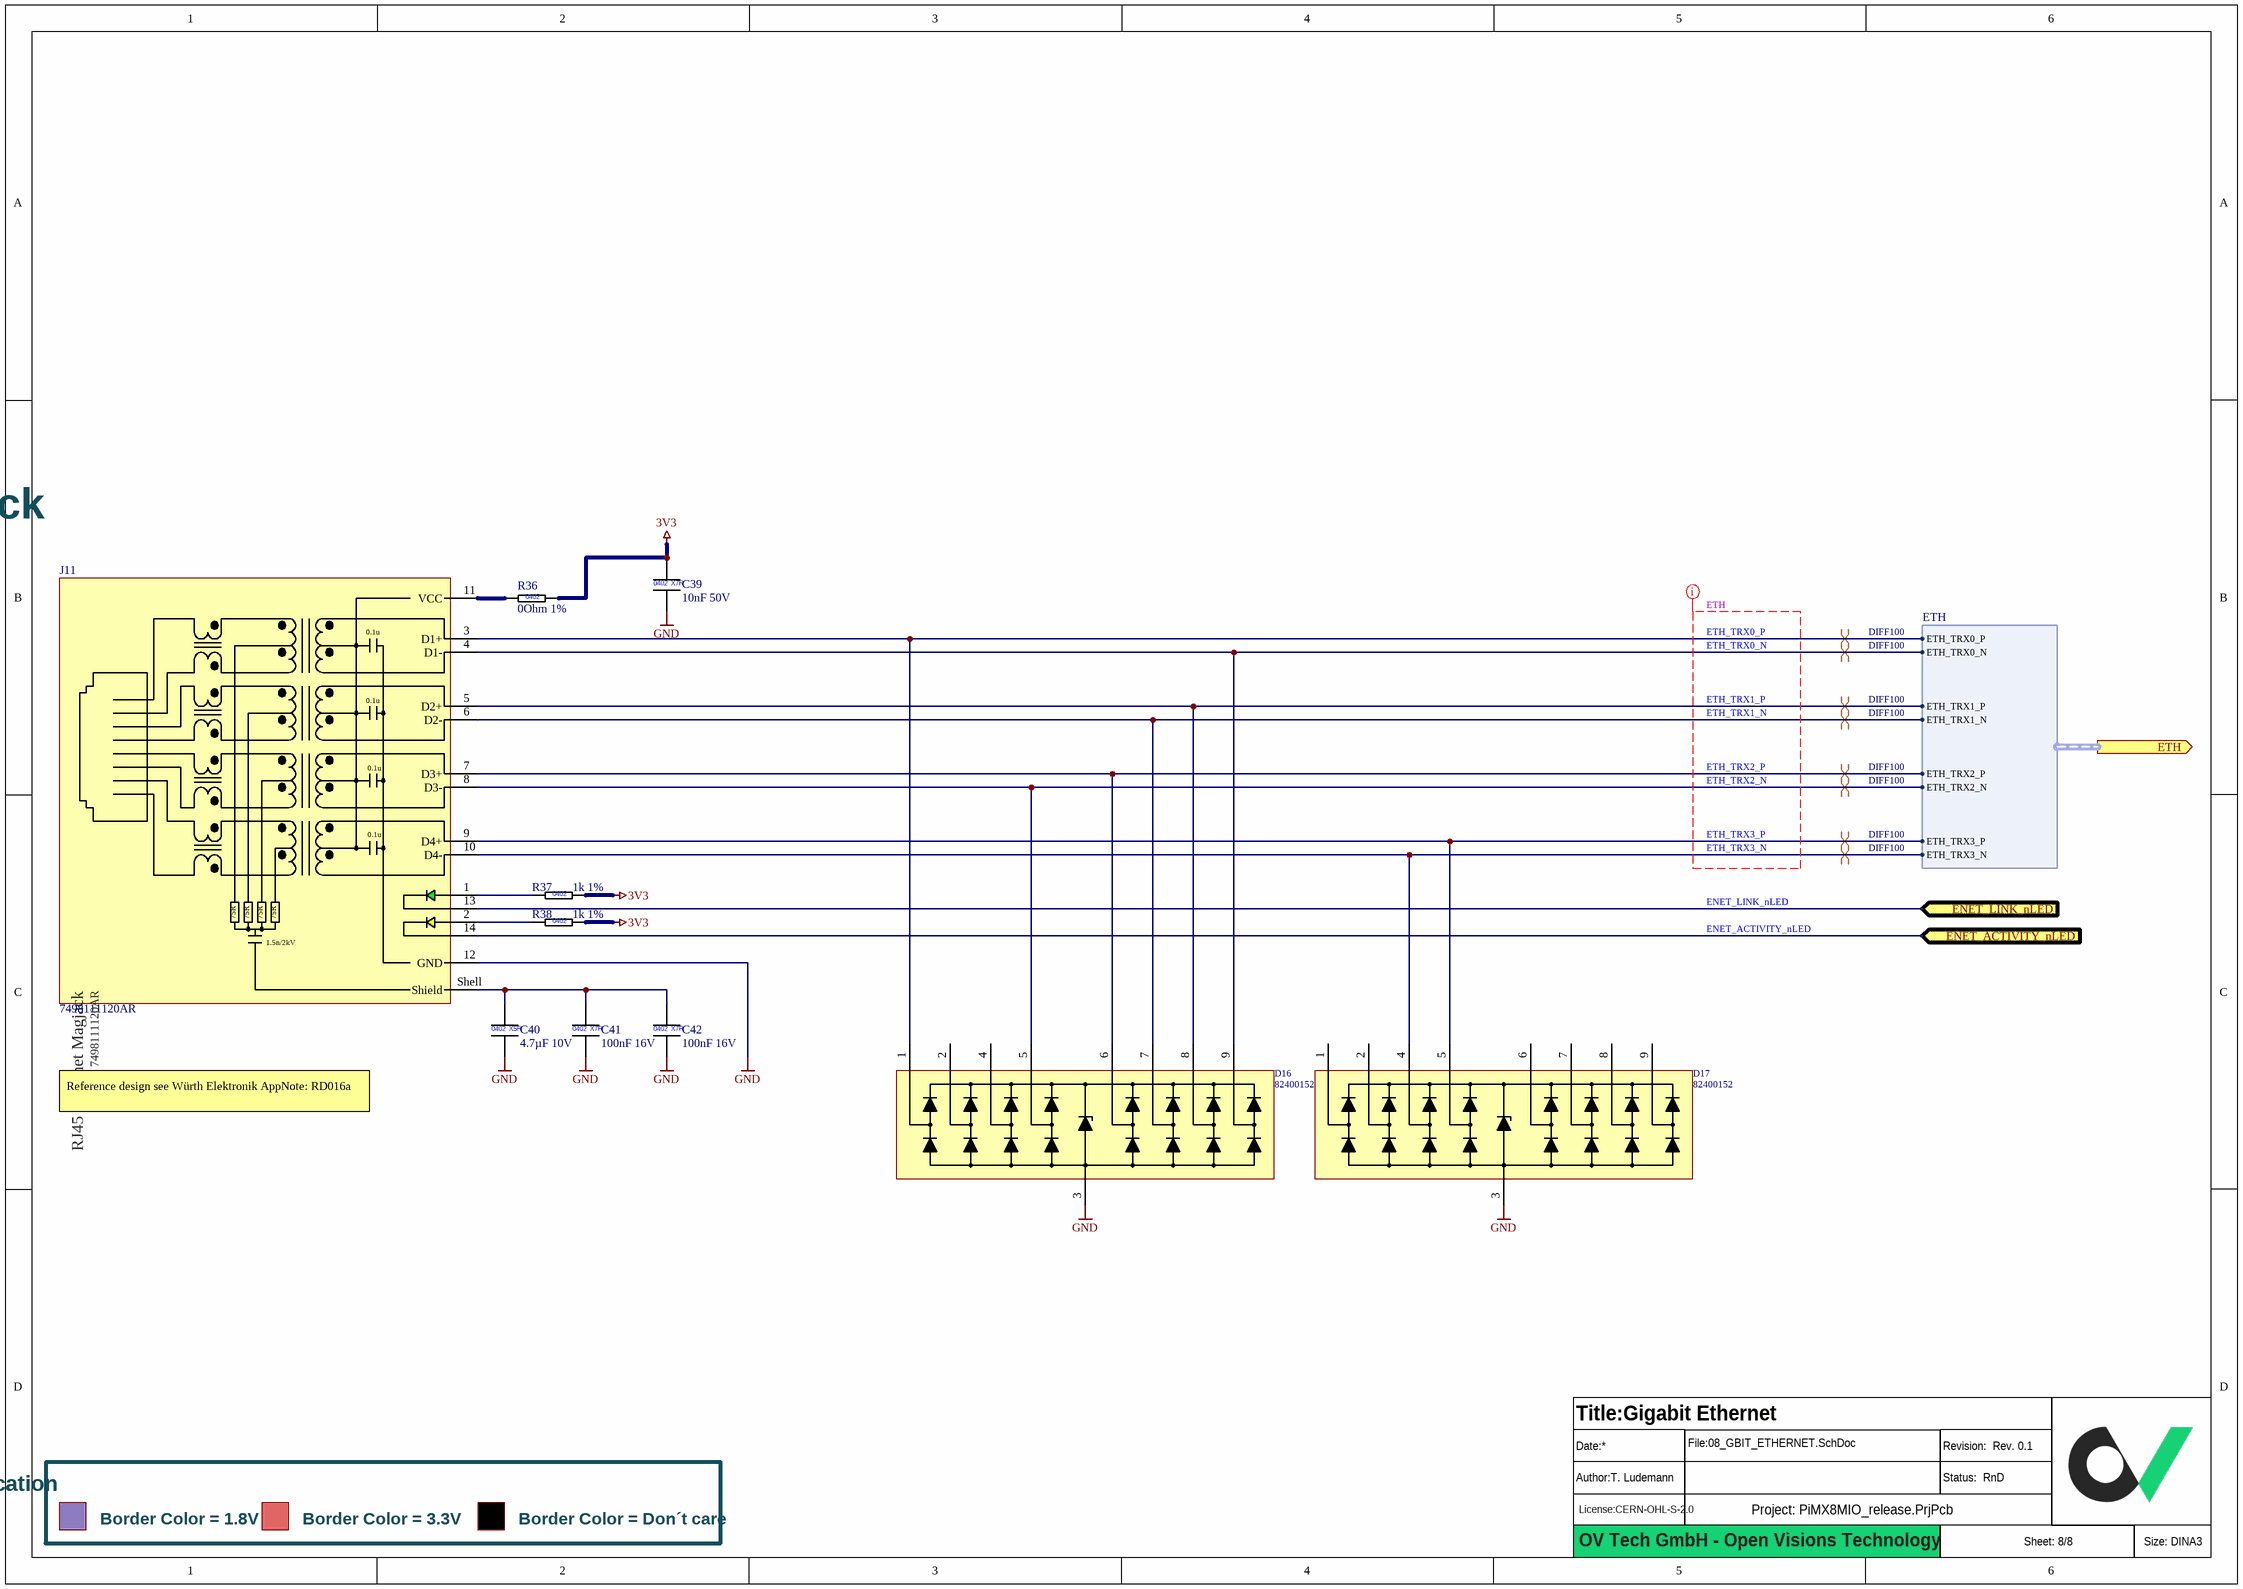
[diagram p9: 08_GBIT_ETHERNET.SchDoc]

### Parts
(Parts that share a designator on the sheet are numbered #1, #2 ... from top to bottom, then left to right.)
?#7  (no value)  (graphical)
C39  10nF 50V  [CAPC1005X06L]
C40  4.7µF 10V  [CAPC1005X06L]
C41  100nF 16V  [CAPC1005X06L]
C42  100nF 16V  [CAPC1005X06L]
D16  82400152  [WE-TVS_DFN3810-9L]
D17  82400152  [WE-TVS_DFN3810-9L]
J11  7498111120AR  [ETH-RJ45-7498111120AR]
R36  0Ohm 1%  [RESC1005X04L]
R37  1k 1%  [RESC1005X04L]
R38  1k 1%  [RESC1005X04L]

### Ports
ENET_ACTIVITY_nLED (in), ENET_LINK_nLED (in), ETH (out, harness ETH)

### Harnesses
ETH: ETH_TRX0_P, ETH_TRX0_N, ETH_TRX1_N, ETH_TRX1_P, ETH_TRX2_P, ETH_TRX2_N, ETH_TRX3_P, ETH_TRX3_N

### Nets
3V3: C39.1 R36.2 R37.2 R38.2
GND: C39.2 C40.2 C41.2 C42.2 D16.3(GND) D17.3(GND) J11.12(GND)
ENET_ACTIVITY_nLED: J11.14 ; port ENET_ACTIVITY_nLED
ENET_LINK_nLED: J11.13 ; port ENET_LINK_nLED
ETH_TRX0_N: D16.9(I/O_9) J11.4(D1-) ; port ETH.ETH_TRX0_N
ETH_TRX0_P: D16.1(I/O_1) J11.3(D1+) ; port ETH.ETH_TRX0_P
ETH_TRX1_N: D16.7(I/O_7) J11.6(D2-) ; port ETH.ETH_TRX1_N
ETH_TRX1_P: D16.8(I/O_8) J11.5(D2+) ; port ETH.ETH_TRX1_P
ETH_TRX2_N: D16.5(I/O_5) J11.8(D3-) ; port ETH.ETH_TRX2_N
ETH_TRX2_P: D16.6(I/O_6) J11.7(D3+) ; port ETH.ETH_TRX2_P
ETH_TRX3_N: D17.4(I/O_4) J11.10(D4-) ; port ETH.ETH_TRX3_N
ETH_TRX3_P: D17.5(I/O_5) J11.9(D4+) ; port ETH.ETH_TRX3_P
NetC40_1: C40.1 C41.1 C42.1 J11.Shell(Shield)
NetJ11_1: J11.1 R37.1
NetJ11_2: J11.2 R38.1
NetJ11_11: J11.11(VCC) R36.1

Not connected (* = marked no-connect by the designer): D16 2(I/O_2) 4(I/O_4); D17 1(I/O_1) 2(I/O_2) 6(I/O_6) 7(I/O_7) 8(I/O_8) 9(I/O_9)

### Layout directives
net class ETH: ETH_TRX0_N, ETH_TRX0_P, ETH_TRX1_N, ETH_TRX1_P, ETH_TRX2_N, ETH_TRX2_P, ETH_TRX3_N, ETH_TRX3_P
differential pair; differential pair class DIFF100: ETH_TRX0_N, ETH_TRX0_P, ETH_TRX1_N, ETH_TRX1_P, ETH_TRX2_N, ETH_TRX2_P, ETH_TRX3_N, ETH_TRX3_P

### Notes on the sheet
- Gbit Ethernet MagJack
- Reference design see Würth Elektronik AppNote: RD016a
- Signal Level Indication
- Border Color = 1.8V
- Border Color = 3.3V
- Border Color = Don´t care
- OV Tech GmbH - Open Visions Technology
- (in symbol CAP_0402_4.7µ_10V) 0402; X5R
- (in symbol CAP_0402_10nF_50V) 0402; X7R
- (in symbol CAP_0402_100nF_16V) 0402; X7R
- (in symbol ETH-RJ45_7498111120AR) 0.1u; 75R; 1.5n/2kV; RJ45 Ethernet Magjack
- (in symbol RES_0402_0R_1%) 0402
- (in symbol RES_0402_1k_1%) 0402

### Library data of the parts
?#7 = Titleblock_01_OpenSource
C39 = CAP_0402_10nF_50V: Multilayer Ceramic Capacitors MLCC - SMD/SMT 0402 50VDC; Manufacturer 1: Murata Electronics; Manufacturer 1 Prt. Nr.: GCM155R71H103KA55J; Manufacturer 2 Prt. Nr.: C0402C103K5RAC7411; Manufacturer 2: KEMET
C40 = CAP_0402_4.7µ_10V: Multilayer Ceramic Capacitors MLCC - SMD/SMT 0402 10VDC; Manufacturer 1: Murata Electronics; Manufacturer 1 Prt. Nr.: GRM155R61A475MEAAD; Manufacturer 2 Prt. Nr.: MSASL105BB5475MFNB33; Manufacturer 2: Taiyo Yuden
C41 C42 = CAP_0402_100nF_16V: as C2 on sheet 04_USB_PWR; Manufacturer 2: Taiyo Yuden
D16 D17 = ESD 5.5V_824014885: WE-TVS TVS Diode – Super Speed Series; Manufacturer 1: Würth Elektronik; Manufacturer 1 Prt. Nr.: 824014885
J11 = ETH-RJ45_7498111120AR: Rj45 Conn, Jack, 8P8C, 1Port, Smt; Manufacturer 1: Würth Elektronik; Manufacturer 1 Prt. Nr.: 7498111120AR
R36 = RES_0402_0R_1%: as R2 on sheet 02_B2B_CON_P1-P100; Manufacturer 2: YAGEO
R37 R38 = RES_0402_1k_1%: Thick Film Resistors - SMD 1k 1%; Manufacturer 1: Vishay / Dale; Manufacturer 1 Prt. Nr.: CRCW04021K00FKEDC; Manufacturer 2 Prt. Nr.: RT0402FRE131KL; Manufacturer 2: YAGEO

## Sheet 03_B2B_CON_P101-P200.SchDoc: PiMX8MP Board to board connector P100 - P200
size 420 x 297 mm; Author: T. Ludemann; SheetNumber: 3; SheetTotal: 8; DocSize: DINA3
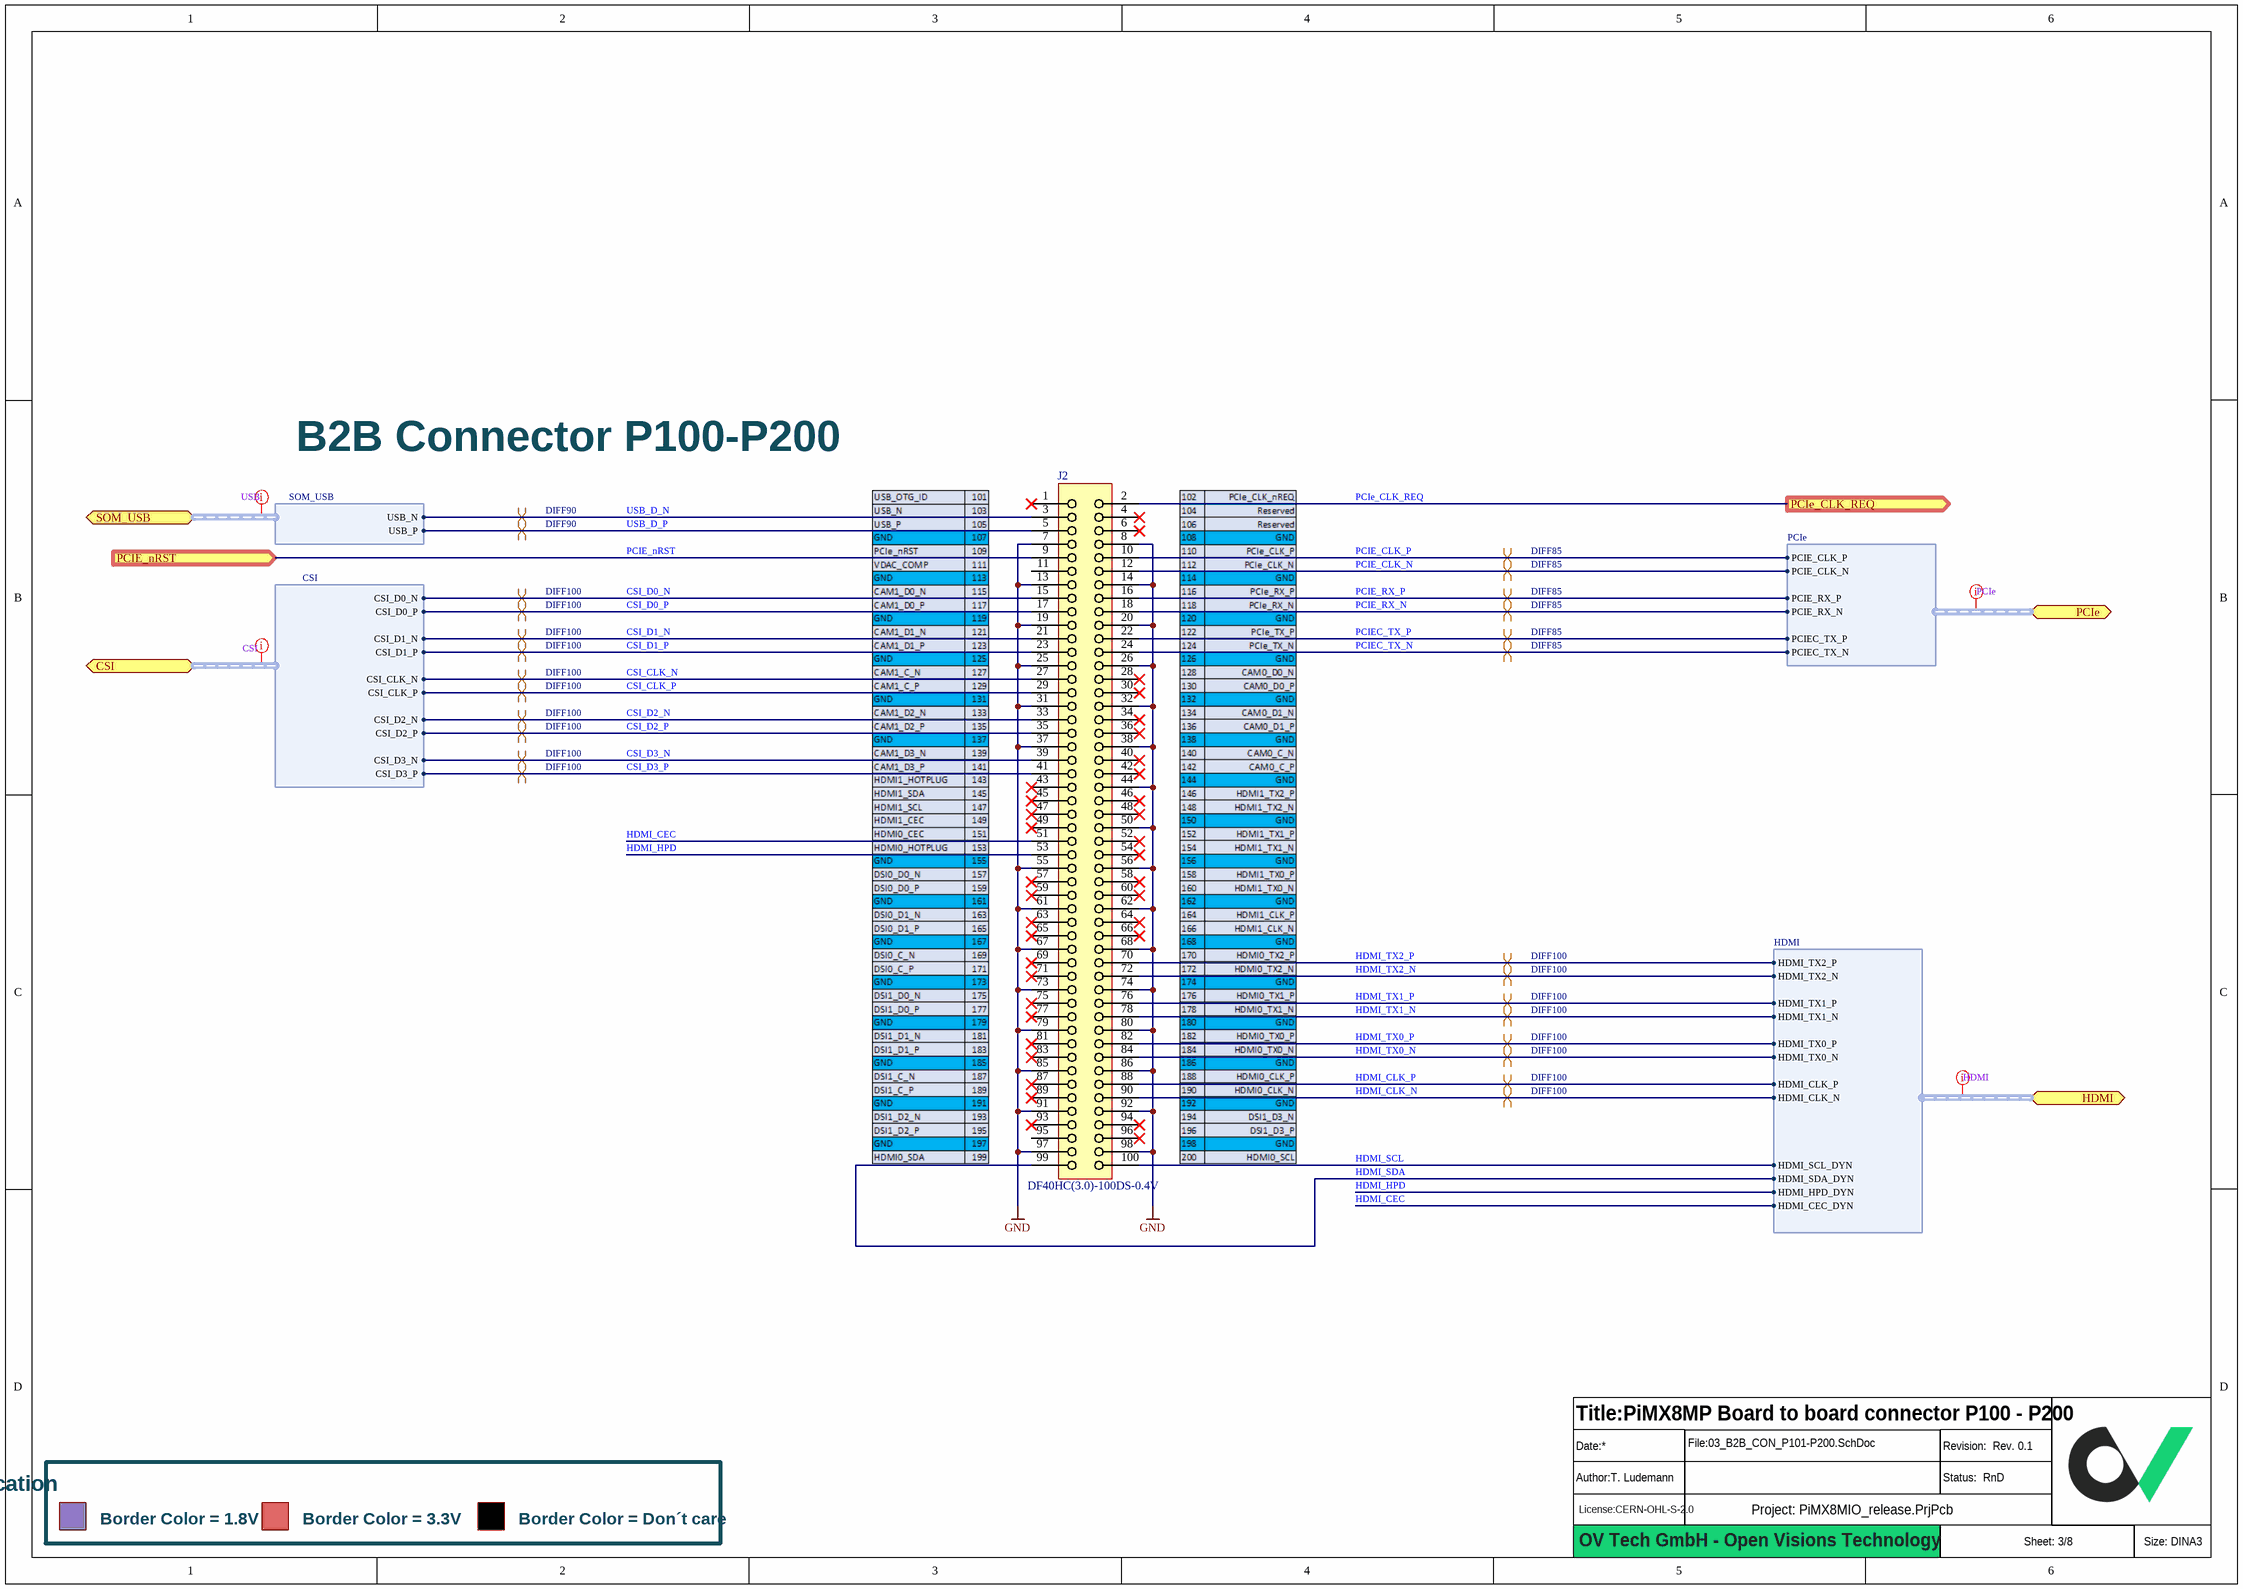
[diagram p10: 03_B2B_CON_P101-P200.SchDoc]

### Parts
(Parts that share a designator on the sheet are numbered #1, #2 ... from top to bottom, then left to right.)
?#8  (no value)  (graphical)
J2  DF40HC(3.0)-100DS-0.4V  [BOARD-TO-BOARD DF40HC(3.0)-100DS-0.4V]

### Ports
CSI (bidir, harness CSI), HDMI (bidir, harness HDMI), PCIe (bidir, harness PCIe), PCIe_CLK_REQ (out), PCIE_nRST (in), SOM_USB (bidir, harness SOM_USB)

### Harnesses
SOM_USB: USB_P, USB_N
HDMI: HDMI_SCL_DYN, HDMI_SDA_DYN, HDMI_HPD_DYN, HDMI_CEC_DYN, HDMI_CLK_N, HDMI_CLK_P, HDMI_TX0_N, HDMI_TX0_P, HDMI_TX1_N, HDMI_TX1_P, HDMI_TX2_N, HDMI_TX2_P
CSI: CSI_D0_N, CSI_D0_P, CSI_D1_N, CSI_D1_P, CSI_CLK_N, CSI_CLK_P, CSI_D2_N, CSI_D2_P, CSI_D3_N, CSI_D3_P
PCIe: PCIE_CLK_N, PCIE_CLK_P, PCIEC_TX_N, PCIE_RX_P, PCIE_RX_N, PCIEC_TX_P

### Nets
GND: J2.7 J2.8 J2.13 J2.14 J2.19 J2.20 J2.25 J2.26 J2.31 J2.32 J2.37 J2.38 J2.44 J2.50 J2.55 J2.56 J2.61 J2.62 J2.67 J2.68 J2.73 J2.74 J2.79 J2.80 J2.85 J2.86 J2.91 J2.92 J2.97 J2.98
CSI_CLK_N: J2.27 ; port CSI.CSI_CLK_N
CSI_CLK_P: J2.29 ; port CSI.CSI_CLK_P
CSI_D0_N: J2.15 ; port CSI.CSI_D0_N
CSI_D0_P: J2.17 ; port CSI.CSI_D0_P
CSI_D1_N: J2.21 ; port CSI.CSI_D1_N
CSI_D1_P: J2.23 ; port CSI.CSI_D1_P
CSI_D2_N: J2.33 ; port CSI.CSI_D2_N
CSI_D2_P: J2.35 ; port CSI.CSI_D2_P
CSI_D3_N: J2.39 ; port CSI.CSI_D3_N
CSI_D3_P: J2.41 ; port CSI.CSI_D3_P
HDMI_CEC: J2.51 ; port HDMI.HDMI_CEC_DYN
HDMI_CLK_N: J2.90 ; port HDMI.HDMI_CLK_N
HDMI_CLK_P: J2.88 ; port HDMI.HDMI_CLK_P
HDMI_HPD: J2.53 ; port HDMI.HDMI_HPD_DYN
HDMI_SCL: J2.100 ; port HDMI.HDMI_SCL_DYN
HDMI_SDA: J2.99 ; port HDMI.HDMI_SDA_DYN
HDMI_TX0_N: J2.84 ; port HDMI.HDMI_TX0_N
HDMI_TX0_P: J2.82 ; port HDMI.HDMI_TX0_P
HDMI_TX1_N: J2.78 ; port HDMI.HDMI_TX1_N
HDMI_TX1_P: J2.76 ; port HDMI.HDMI_TX1_P
HDMI_TX2_N: J2.72 ; port HDMI.HDMI_TX2_N
HDMI_TX2_P: J2.70 ; port HDMI.HDMI_TX2_P
PCIE_CLK_N: J2.12 ; port PCIe.PCIE_CLK_N
PCIE_CLK_P: J2.10 ; port PCIe.PCIE_CLK_P
PCIe_CLK_REQ: J2.2 ; port PCIe_CLK_REQ
PCIE_nRST: J2.9 ; port PCIE_nRST
PCIE_RX_N: J2.18 ; port PCIe.PCIE_RX_N
PCIE_RX_P: J2.16 ; port PCIe.PCIE_RX_P
PCIEC_TX_N: J2.24 ; port PCIe.PCIEC_TX_N
PCIEC_TX_P: J2.22 ; port PCIe.PCIEC_TX_P
USB_D_N: J2.3 ; port SOM_USB.USB_N  [project net MUX_USB_N]
USB_D_P: J2.5 ; port SOM_USB.USB_P  [project net MUX_USB_P]

Not connected (* = marked no-connect by the designer): J2 1* 4* 6* 11 28* 30* 34* 36* 40* 42* 43* 45* 46* 47* 48* 49* 52* 54* 57* 58* 59* 60* 63* 64* 65* 66* 69* 71* 75* 77* 81* 83* 87* 89* 93* 94* 95 96*

### Layout directives
net class USB: (no net found under the mark)
net class HDMI: (no net found under the mark)
differential pair; differential pair class DIFF100: CSI_CLK_N, CSI_CLK_P, CSI_D0_N, CSI_D0_P, CSI_D1_N, CSI_D1_P, CSI_D2_N, CSI_D2_P, CSI_D3_N, CSI_D3_P, HDMI_CLK_N, HDMI_CLK_P, HDMI_TX0_N, HDMI_TX0_P, HDMI_TX1_N, HDMI_TX1_P, HDMI_TX2_N, HDMI_TX2_P
differential pair; differential pair class DIFF90: MUX_USB_N, MUX_USB_P
net class CSI: (no net found under the mark)
net class PCIe: (no net found under the mark)
differential pair; differential pair class DIFF85: PCIE_CLK_N, PCIE_CLK_P, PCIE_RX_N, PCIE_RX_P, PCIEC_TX_N, PCIEC_TX_P

### Notes on the sheet
- (near J2) B2B Connector P100-P200
- Signal Level Indication
- Border Color = 1.8V
- Border Color = 3.3V
- Border Color = Don´t care
- OV Tech GmbH - Open Visions Technology

### Library data of the parts
?#8 = Titleblock_01_OpenSource
J2 = Board to Board Connector Receptable_BTB_100P_04mm_DF40HC(3.0)-100DS-0.4V: as J1 on sheet 02_B2B_CON_P1-P100; Manufacturer 1 Prt. Nr.: DF40HC(3.0)-100DS-0.4V

## Nets that join several sheets
1V8: 02_B2B_CON_P1-P100 (J1.88 J1.90 R5.2), 05_FPC_DB (J8.P3)
3V3: 02_B2B_CON_P1-P100 (6 pins), 04_USB_PWR (32 pins), 05_FPC_DB (J8.P1), 06_SD_CARD (R34.2), 08_GBIT_ETHERNET (C39.1 R36.2 R37.2 R38.2)
5V0: 02_B2B_CON_P1-P100 (6 pins), 04_USB_PWR (7 pins), 07_HDMI (C38.1 U7.4 U7.6)
GND: 01_BLOCK_DIAGRAM (H1.MT H2.MT H3.MT H4.MT), 02_B2B_CON_P1-P100 (23 pins), 04_USB_PWR (76 pins), 05_FPC_DB (30 pins), 06_SD_CARD (18 pins), 07_HDMI (18 pins), 08_GBIT_ETHERNET (7 pins), 03_B2B_CON_P101-P200 (30 pins)
ALERT#_1P8: 02_B2B_CON_P1-P100 (J1.28), 05_FPC_DB (J8.16)
CAM_GPIO: 02_B2B_CON_P1-P100 (J1.34), 05_FPC_DB (J8.48)
CAM_I2C_SCL: 02_B2B_CON_P1-P100 (J1.82), 05_FPC_DB (J8.52)
CAM_I2C_SDA: 02_B2B_CON_P1-P100 (J1.80), 05_FPC_DB (J8.50)
CPU_RUN_PG: 02_B2B_CON_P1-P100 (J1.92), 04_USB_PWR (R18.2 U9.2)
CSI_CLK_N: 05_FPC_DB (J8.13), 03_B2B_CON_P101-P200 (J2.27)
CSI_CLK_P: 05_FPC_DB (J8.15), 03_B2B_CON_P101-P200 (J2.29)
CSI_D0_N: 05_FPC_DB (J8.1), 03_B2B_CON_P101-P200 (J2.15)
CSI_D0_P: 05_FPC_DB (J8.3), 03_B2B_CON_P101-P200 (J2.17)
CSI_D1_N: 05_FPC_DB (J8.7), 03_B2B_CON_P101-P200 (J2.21)
CSI_D1_P: 05_FPC_DB (J8.9), 03_B2B_CON_P101-P200 (J2.23)
CSI_D2_N: 05_FPC_DB (J8.19), 03_B2B_CON_P101-P200 (J2.33)
CSI_D2_P: 05_FPC_DB (J8.21), 03_B2B_CON_P101-P200 (J2.35)
CSI_D3_N: 05_FPC_DB (J8.25), 03_B2B_CON_P101-P200 (J2.39)
CSI_D3_P: 05_FPC_DB (J8.27), 03_B2B_CON_P101-P200 (J2.41)
ENET_ACTIVITY_nLED: 02_B2B_CON_P1-P100 (J1.15), 08_GBIT_ETHERNET (J11.14)
ENET_LINK_nLED: 02_B2B_CON_P1-P100 (J1.17), 08_GBIT_ETHERNET (J11.13)
ETH_TRX0_N: 02_B2B_CON_P1-P100 (J1.10), 08_GBIT_ETHERNET (D16.9 J11.4)
ETH_TRX0_P: 02_B2B_CON_P1-P100 (J1.12), 08_GBIT_ETHERNET (D16.1 J11.3)
ETH_TRX1_N: 02_B2B_CON_P1-P100 (J1.6), 08_GBIT_ETHERNET (D16.7 J11.6)
ETH_TRX1_P: 02_B2B_CON_P1-P100 (J1.4), 08_GBIT_ETHERNET (D16.8 J11.5)
ETH_TRX2_N: 02_B2B_CON_P1-P100 (J1.9), 08_GBIT_ETHERNET (D16.5 J11.8)
ETH_TRX2_P: 02_B2B_CON_P1-P100 (J1.11), 08_GBIT_ETHERNET (D16.6 J11.7)
ETH_TRX3_N: 02_B2B_CON_P1-P100 (J1.5), 08_GBIT_ETHERNET (D17.4 J11.10)
ETH_TRX3_P: 02_B2B_CON_P1-P100 (J1.3), 08_GBIT_ETHERNET (D17.5 J11.9)
FPC_PEWAKE0#_3P3: 02_B2B_CON_P1-P100 (J1.24), 05_FPC_DB (J8.55)
HDMI_CEC: 07_HDMI (D14.5 J10.13), 03_B2B_CON_P101-P200 (J2.51)
HDMI_CLK_N: 07_HDMI (L5.C4), 03_B2B_CON_P101-P200 (J2.90)
HDMI_CLK_P: 07_HDMI (L5.C3), 03_B2B_CON_P101-P200 (J2.88)
HDMI_HPD: 07_HDMI (D14.1 J10.19), 03_B2B_CON_P101-P200 (J2.53)
HDMI_SCL: 07_HDMI (D14.4 J10.15), 03_B2B_CON_P101-P200 (J2.100)
HDMI_SDA: 07_HDMI (D14.2 J10.16), 03_B2B_CON_P101-P200 (J2.99)
HDMI_TX0_N: 07_HDMI (L5.C2), 03_B2B_CON_P101-P200 (J2.84)
HDMI_TX0_P: 07_HDMI (L5.C1), 03_B2B_CON_P101-P200 (J2.82)
HDMI_TX1_N: 07_HDMI (L4.C4), 03_B2B_CON_P101-P200 (J2.78)
HDMI_TX1_P: 07_HDMI (L4.C3), 03_B2B_CON_P101-P200 (J2.76)
HDMI_TX2_N: 07_HDMI (L4.C2), 03_B2B_CON_P101-P200 (J2.72)
HDMI_TX2_P: 07_HDMI (L4.C1), 03_B2B_CON_P101-P200 (J2.70)
I2C_SCL: 02_B2B_CON_P1-P100 (J1.56), 05_FPC_DB (J8.20)
I2C_SDA: 02_B2B_CON_P1-P100 (J1.58), 05_FPC_DB (J8.18)
MUX_USB_N: 04_USB_PWR (U2.2), 03_B2B_CON_P101-P200 (J2.3)
MUX_USB_P: 04_USB_PWR (U2.1), 03_B2B_CON_P101-P200 (J2.5)
PCIE_CLK_N: 05_FPC_DB (J8.43), 03_B2B_CON_P101-P200 (J2.12)
PCIE_CLK_P: 05_FPC_DB (J8.45), 03_B2B_CON_P101-P200 (J2.10)
PCIe_CLK_REQ: 05_FPC_DB (J8.53), 03_B2B_CON_P101-P200 (J2.2)
PCIE_nRST: 05_FPC_DB (J8.51), 03_B2B_CON_P101-P200 (J2.9)
PCIE_RX_N: 05_FPC_DB (J8.37), 03_B2B_CON_P101-P200 (J2.18)
PCIE_RX_P: 05_FPC_DB (J8.39), 03_B2B_CON_P101-P200 (J2.16)
PCIEC_TX_N: 05_FPC_DB (J8.31), 03_B2B_CON_P101-P200 (J2.24)
PCIEC_TX_P: 05_FPC_DB (J8.33), 03_B2B_CON_P101-P200 (J2.22)
PCM_MCLK: 02_B2B_CON_P1-P100 (J1.40 R2.1), 05_FPC_DB (J8.28)
PCM_RX_IN: 02_B2B_CON_P1-P100 (J1.26), 05_FPC_DB (J8.32)
PCM_RX_SYNC: 02_B2B_CON_P1-P100 (J1.25), 05_FPC_DB (J8.44)
PCM_TX_OUT: 02_B2B_CON_P1-P100 (J1.44), 05_FPC_DB (J8.36)
PCM_TX_SYNC: 02_B2B_CON_P1-P100 (J1.49), 05_FPC_DB (J8.40)
SD_CD: 02_B2B_CON_P1-P100 (J1.76), 06_SD_CARD (D7.1 J9.9 R34.1)
SD_CLK: 02_B2B_CON_P1-P100 (J1.57), 06_SD_CARD (D12.1 J9.5)
SD_CMD: 02_B2B_CON_P1-P100 (J1.62), 06_SD_CARD (D13.1 J9.3 R28.1)
SD_DATA0: 02_B2B_CON_P1-P100 (J1.63), 06_SD_CARD (D8.1 J9.7 R32.1)
SD_DATA1: 02_B2B_CON_P1-P100 (J1.67), 06_SD_CARD (D9.1 J9.8 R31.1)
SD_DATA2: 02_B2B_CON_P1-P100 (J1.69), 06_SD_CARD (D10.1 J9.1 R30.1)
SD_DATA3: 02_B2B_CON_P1-P100 (J1.61), 06_SD_CARD (D11.1 J9.2 R29.1)
SD_POWER: 02_B2B_CON_P1-P100 (J1.75), 06_SD_CARD (8 pins)
UART_nWAKE: 02_B2B_CON_P1-P100 (J1.30), 05_FPC_DB (J8.24)
USB-BOOT_MODE: 02_B2B_CON_P1-P100 (J1.93), 04_USB_PWR (Q1.3)
USB_FPC1_N: 04_USB_PWR (U4.6), 05_FPC_DB (J8.10)
USB_FPC1_P: 04_USB_PWR (U4.7), 05_FPC_DB (J8.12)
USB_FPC2_N: 04_USB_PWR (U4.8), 05_FPC_DB (J8.4)
USB_FPC2_P: 04_USB_PWR (U4.9), 05_FPC_DB (J8.2)
USB_HUB_NRESET: 02_B2B_CON_P1-P100 (J1.29), 04_USB_PWR (C19.1 R24.1 U4.26)